# Altium project ALTAIR.PrjPcb (part 1 of 2)
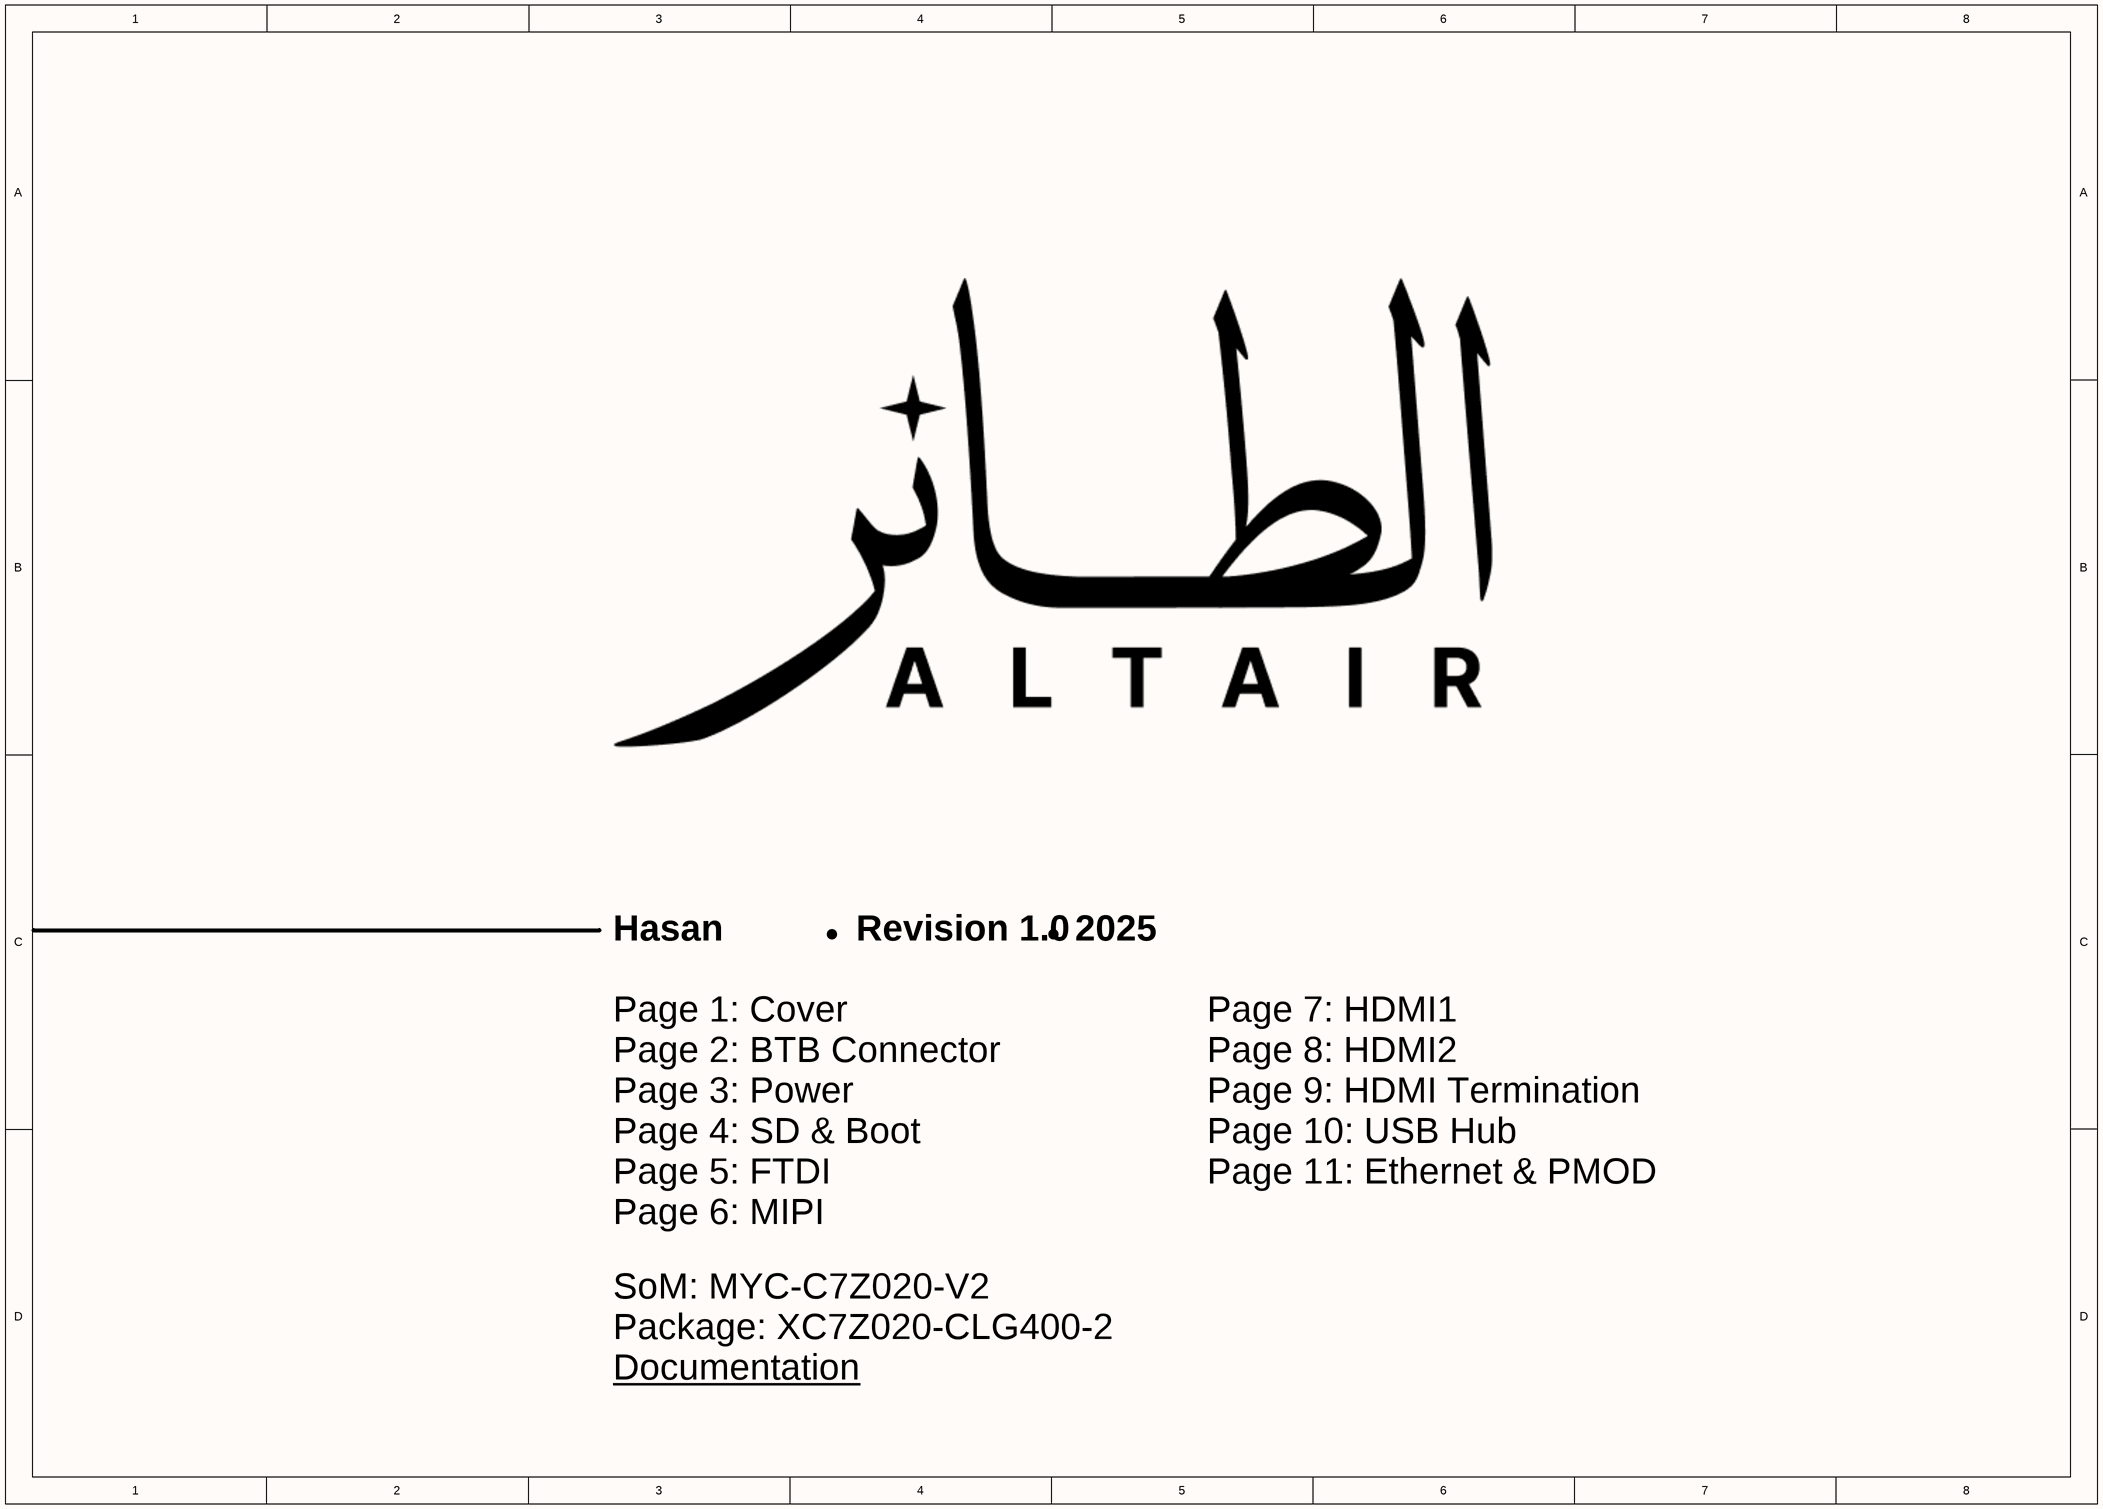
[diagram p0: Cover.SchDoc]

11 sheets, 524 parts. Net scope: global (net labels, ports and power ports of the same name join across sheets).
Board file: PCB1.PcbDoc
Sheets:
  Cover.SchDoc
  BTB Mezzanine.SchDoc
  Power.SchDoc
  SD & Boot.SchDoc
  FTDI.SchDoc
  MIPI.SchDoc
  HDMI1.SchDoc
  HDMI2.SchDoc
  HDMI Termination.SchDoc
  USB.SchDoc
  Ethernet & PMOD.SchDoc

## Sheet Cover.SchDoc: ALTAIR
size A3; SheetNumber: 1; SheetTotal: 11

### Notes on the sheet
- Hasan
- ·
- Revision 1.0
- 2025
- Page 1: Cover
- Page 7: HDMI1
- Page 2: BTB Connector
- Page 3: Power
- Page 8: HDMI2
- Page 9: HDMI Termination
- Page 4: SD & Boot
- Page 5: FTDI
- Page 10: USB Hub
- Page 11: Ethernet & PMOD
- Page 6: MIPI
- SoM: MYC-C7Z020-V2
- Package: XC7Z020-CLG400-2
- Documentation <https://github.com/HasanTheSyrian/ALTAIR>
- THIS DOCUMENT AND THE DATA DISCLOSED HEREIN OR
- HEREWITH IS THE PROPERTY OF ALTIUM LIMITED AND MAY
- DWG NO:
- REVISION
- REV:
- DESCRIPTION
- DATE
- APPROVED
- BE FREELY DISTRIBUTED IN WHOLE. NO RIGHTS ARE
- RESERVED OR EXPRESS OR IMPLIED WARANTEE GIVEN.
- ENG:
- APPROVALS
- PROJECT
- DSN:
- CHK:
- REFERENCE DOCUMENTS
- PROJECT REVISION:
- TITLE
- DOCUMENT REVISION:
- DESIGN ITEM:
- BOM:
- FAB DWG:
- PCB DWG:
- ASSY DWG:
- SCALE:
- A3
- SIZE
- CAGE CODE
- FILE NAME
- DWG NO.
- SHEET
- OF
- REV

## Sheet BTB Mezzanine.SchDoc
size A3; SheetNumber: 2; SheetTotal: 11
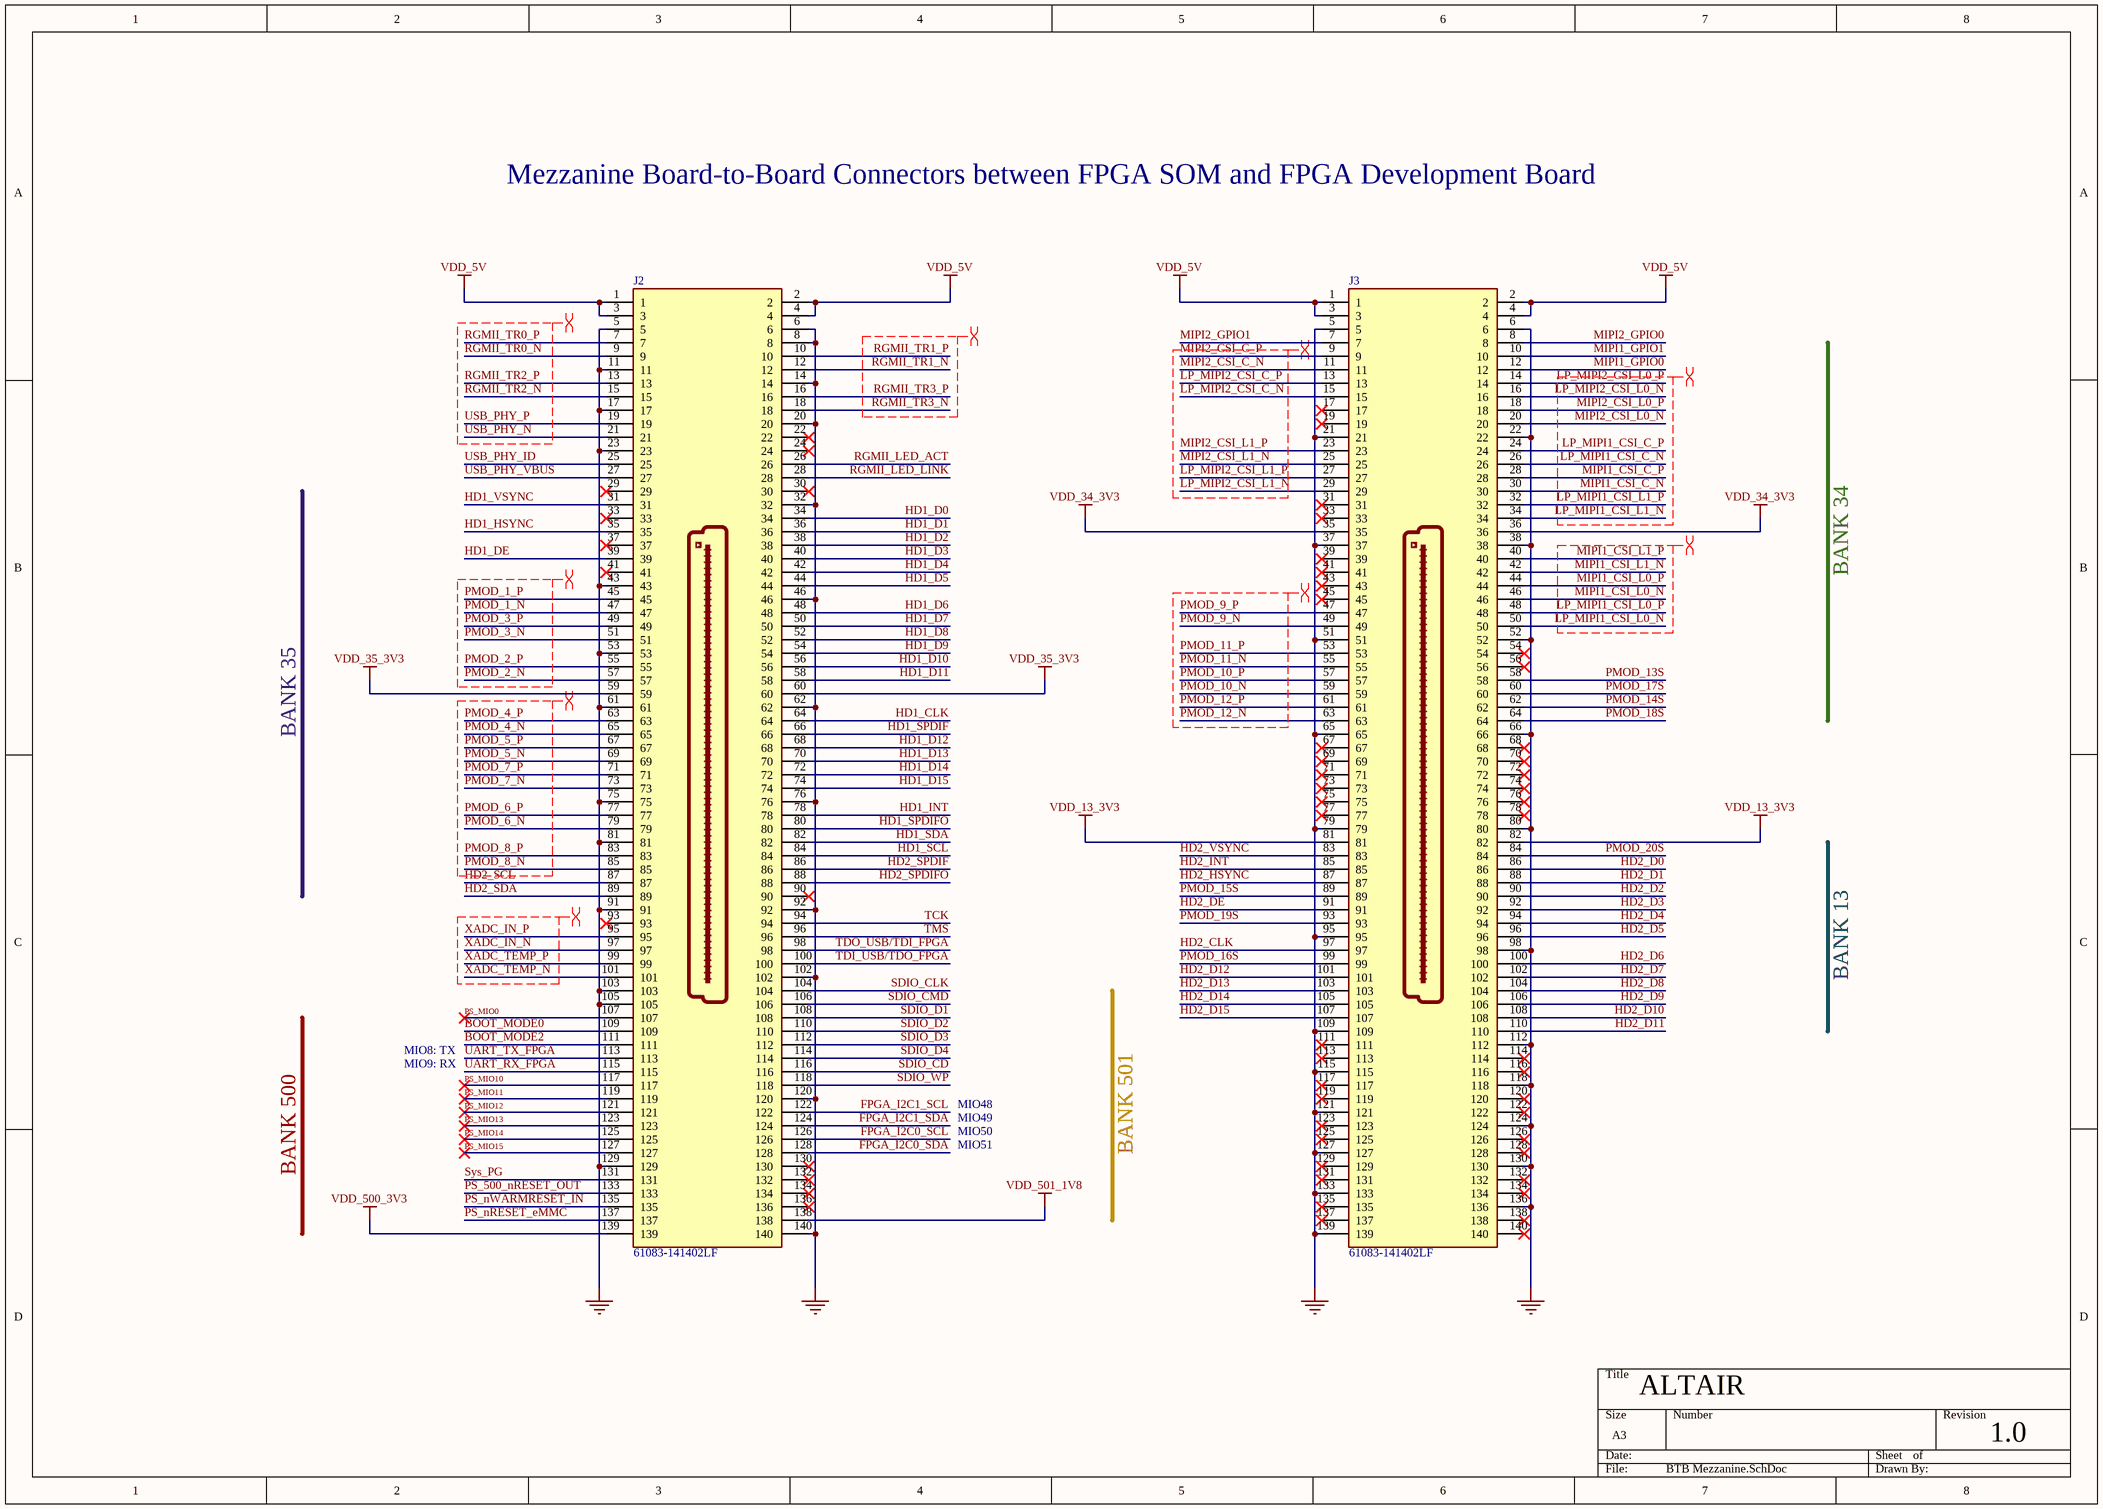
[diagram p1: BTB Mezzanine.SchDoc]

### Parts
J2  61083-141402LF  [61083141402LF]
J3  61083-141402LF  [61083141402LF]

### Nets
GND: J2.5 J2.6 J2.8 J2.11 J2.14 J2.17 J2.20 J2.23 J2.32 J2.43 J2.46 J2.53 J2.61 J2.62 J2.75 J2.76 J2.81 J2.91 J2.92 J2.102 J2.103 J2.105 J2.120 J2.129 J2.140 J3.5 J3.6 J3.21 J3.22 J3.37 J3.38 J3.51 J3.52 J3.65 J3.66 J3.79 J3.80 J3.95 J3.98 J3.109 J3.112 J3.115 J3.118 J3.121 J3.124 J3.127 J3.130 J3.133 J3.136 J3.139
VDD_5V: J2.1 J2.2 J2.3 J2.4 J3.1 J3.2 J3.3 J3.4  [project net 5V]
VDD_13_3V3: J3.81 J3.82
VDD_34_3V3: J3.35 J3.36
VDD_35_3V3: J2.59 J2.60
VDD_500_3V3: J2.139
VDD_501_1V8: J2.138
BOOT_MODE0: J2.109
BOOT_MODE2: J2.111
FPGA_I2C0_SCL: J2.126
FPGA_I2C0_SDA: J2.128
FPGA_I2C1_SCL: J2.122
FPGA_I2C1_SDA: J2.124
HD1_CLK: J2.64
HD1_D0: J2.34
HD1_D1: J2.36
HD1_D2: J2.38
HD1_D3: J2.40
HD1_D4: J2.42
HD1_D5: J2.44
HD1_D6: J2.48
HD1_D7: J2.50
HD1_D8: J2.52
HD1_D9: J2.54
HD1_D10: J2.56
HD1_D11: J2.58
HD1_D12: J2.68
HD1_D13: J2.70
HD1_D14: J2.72
HD1_D15: J2.74
HD1_DE: J2.39
HD1_HSYNC: J2.35
HD1_INT: J2.78
HD1_SCL: J2.84
HD1_SDA: J2.82
HD1_SPDIF: J2.66
HD1_SPDIFO: J2.80
HD1_VSYNC: J2.31
HD2_CLK: J3.97
HD2_D0: J3.86
HD2_D1: J3.88
HD2_D2: J3.90
HD2_D3: J3.92
HD2_D4: J3.94
HD2_D5: J3.96
HD2_D6: J3.100
HD2_D7: J3.102
HD2_D8: J3.104
HD2_D9: J3.106
HD2_D10: J3.108
HD2_D11: J3.110
HD2_D12: J3.101
HD2_D13: J3.103
HD2_D14: J3.105
HD2_D15: J3.107
HD2_DE: J3.91
HD2_HSYNC: J3.87
HD2_INT: J3.85
HD2_SCL: J2.87
HD2_SDA: J2.89
HD2_SPDIF: J2.86
HD2_SPDIFO: J2.88
HD2_VSYNC: J3.83
LP_MIPI1_CSI_C_N: J3.26
LP_MIPI1_CSI_C_P: J3.24
LP_MIPI1_CSI_L0_N: J3.50
LP_MIPI1_CSI_L0_P: J3.48
LP_MIPI1_CSI_L1_N: J3.34
LP_MIPI1_CSI_L1_P: J3.32
LP_MIPI2_CSI_C_N: J3.15
LP_MIPI2_CSI_C_P: J3.13
LP_MIPI2_CSI_L0_N: J3.16
LP_MIPI2_CSI_L0_P: J3.14
LP_MIPI2_CSI_L1_N: J3.29
LP_MIPI2_CSI_L1_P: J3.27
MIPI1_CSI_C_N: J3.30
MIPI1_CSI_C_P: J3.28
MIPI1_CSI_L0_N: J3.46
MIPI1_CSI_L0_P: J3.44
MIPI1_CSI_L1_N: J3.42
MIPI1_CSI_L1_P: J3.40
MIPI1_GPIO0: J3.12
MIPI1_GPIO1: J3.10
MIPI2_CSI_C_N: J3.11
MIPI2_CSI_C_P: J3.9
MIPI2_CSI_L0_N: J3.20
MIPI2_CSI_L0_P: J3.18
MIPI2_CSI_L1_N: J3.25
MIPI2_CSI_L1_P: J3.23
MIPI2_GPIO0: J3.8
MIPI2_GPIO1: J3.7
PMOD_1_N: J2.47
PMOD_1_P: J2.45
PMOD_2_N: J2.57
PMOD_2_P: J2.55
PMOD_3_N: J2.51
PMOD_3_P: J2.49
PMOD_4_N: J2.65
PMOD_4_P: J2.63
PMOD_5_N: J2.69
PMOD_5_P: J2.67
PMOD_6_N: J2.79
PMOD_6_P: J2.77
PMOD_7_N: J2.73
PMOD_7_P: J2.71
PMOD_8_N: J2.85
PMOD_8_P: J2.83
PMOD_9_N: J3.49
PMOD_9_P: J3.47
PMOD_10_N: J3.59
PMOD_10_P: J3.57
PMOD_11_N: J3.55
PMOD_11_P: J3.53
PMOD_12_N: J3.63
PMOD_12_P: J3.61
PMOD_13S: J3.58
PMOD_14S: J3.62
PMOD_15S: J3.89
PMOD_16S: J3.99
PMOD_17S: J3.60
PMOD_18S: J3.64
PMOD_19S: J3.93
PMOD_20S: J3.84
PS_500_nRESET_OUT: J2.133
PS_MIO0: J2.107
PS_MIO10: J2.117
PS_MIO11: J2.119
PS_MIO12: J2.121
PS_MIO13: J2.123
PS_MIO14: J2.125
PS_MIO15: J2.127
PS_nRESET_eMMC: J2.137
PS_nWARMRESET_IN: J2.135
RGMII_LED_ACT: J2.26
RGMII_LED_LINK: J2.28
RGMII_TR0_N: J2.9
RGMII_TR0_P: J2.7
RGMII_TR1_N: J2.12
RGMII_TR1_P: J2.10
RGMII_TR2_N: J2.15
RGMII_TR2_P: J2.13
RGMII_TR3_N: J2.18
RGMII_TR3_P: J2.16
SDIO_CD: J2.116
SDIO_CLK: J2.104
SDIO_CMD: J2.106
SDIO_D1: J2.108
SDIO_D2: J2.110
SDIO_D3: J2.112
SDIO_D4: J2.114
SDIO_WP: J2.118
Sys_PG: J2.131
TCK: J2.94
TDI_USB/TDO_FPGA: J2.100
TDO_USB/TDI_FPGA: J2.98
TMS: J2.96
UART_RX_FPGA: J2.115
UART_TX_FPGA: J2.113
USB_PHY_ID: J2.25
USB_PHY_N: J2.21
USB_PHY_P: J2.19
USB_PHY_VBUS: J2.27
XADC_IN_N: J2.97
XADC_IN_P: J2.95
XADC_TEMP_N: J2.101
XADC_TEMP_P: J2.99

Not connected (* = marked no-connect by the designer): J2 22* 24* 29* 30* 33* 37* 41* 90* 93* 130* 132* 134* 136*; J3 17* 19* 31* 33* 39* 41* 43* 45* 54* 56* 67* 68* 69* 70* 71* 72* 73* 74* 75* 76* 77* 78* 111* 113* 114* 116* 117* 119* 120* 122* 123* 125* 126* 128* 129* 131* 132* 134* 135* 137* 138* 140*

### Layout directives
differential pair: LP_MIPI1_CSI_C_N, LP_MIPI1_CSI_C_P, LP_MIPI1_CSI_L0_N, LP_MIPI1_CSI_L0_P, LP_MIPI1_CSI_L1_N, LP_MIPI1_CSI_L1_P, LP_MIPI2_CSI_C_N, LP_MIPI2_CSI_C_P, LP_MIPI2_CSI_L0_N, LP_MIPI2_CSI_L0_P, LP_MIPI2_CSI_L1_N, LP_MIPI2_CSI_L1_P, MIPI1_CSI_C_N, MIPI1_CSI_C_P, MIPI1_CSI_L0_N, MIPI1_CSI_L0_P, MIPI1_CSI_L1_N, MIPI1_CSI_L1_P, MIPI2_CSI_C_N, MIPI2_CSI_C_P, MIPI2_CSI_L0_N, MIPI2_CSI_L0_P, MIPI2_CSI_L1_N, MIPI2_CSI_L1_P, PMOD_1_N, PMOD_1_P, PMOD_2_N, PMOD_2_P, PMOD_3_N, PMOD_3_P, PMOD_4_N, PMOD_4_P, PMOD_5_N, PMOD_5_P, PMOD_6_N, PMOD_6_P, PMOD_7_N, PMOD_7_P, PMOD_8_N, PMOD_8_P, PMOD_9_N, PMOD_9_P, PMOD_10_N, PMOD_10_P, PMOD_11_N, PMOD_11_P, PMOD_12_N, PMOD_12_P, RGMII_TR0_N, RGMII_TR0_P, RGMII_TR1_N, RGMII_TR1_P, RGMII_TR2_N, RGMII_TR2_P, RGMII_TR3_N, RGMII_TR3_P, USB_PHY_N, USB_PHY_P, XADC_IN_N, XADC_IN_P, XADC_TEMP_N, XADC_TEMP_P

### Notes on the sheet
- Mezzanine Board-to-Board Connectors between FPGA SOM and FPGA Development Board
- BANK 34
- BANK 35
- BANK 13
- MIO8: TX
- MIO9: RX
- MIO49
- MIO48
- BANK 500
- MIO51
- MIO50
- BANK 501
- ALTAIR
- 1.0

### Library data of the parts
J2 J3 = 61083-141402LF: Connector; JLCPCB Part #: C5338666; Part No: 61083-141402LF; Footprint JLCPCB: SMD,P=0.8mm; Note/Misc: *

## Sheet Power.SchDoc
size A3; SheetNumber: 3; SheetTotal: 11
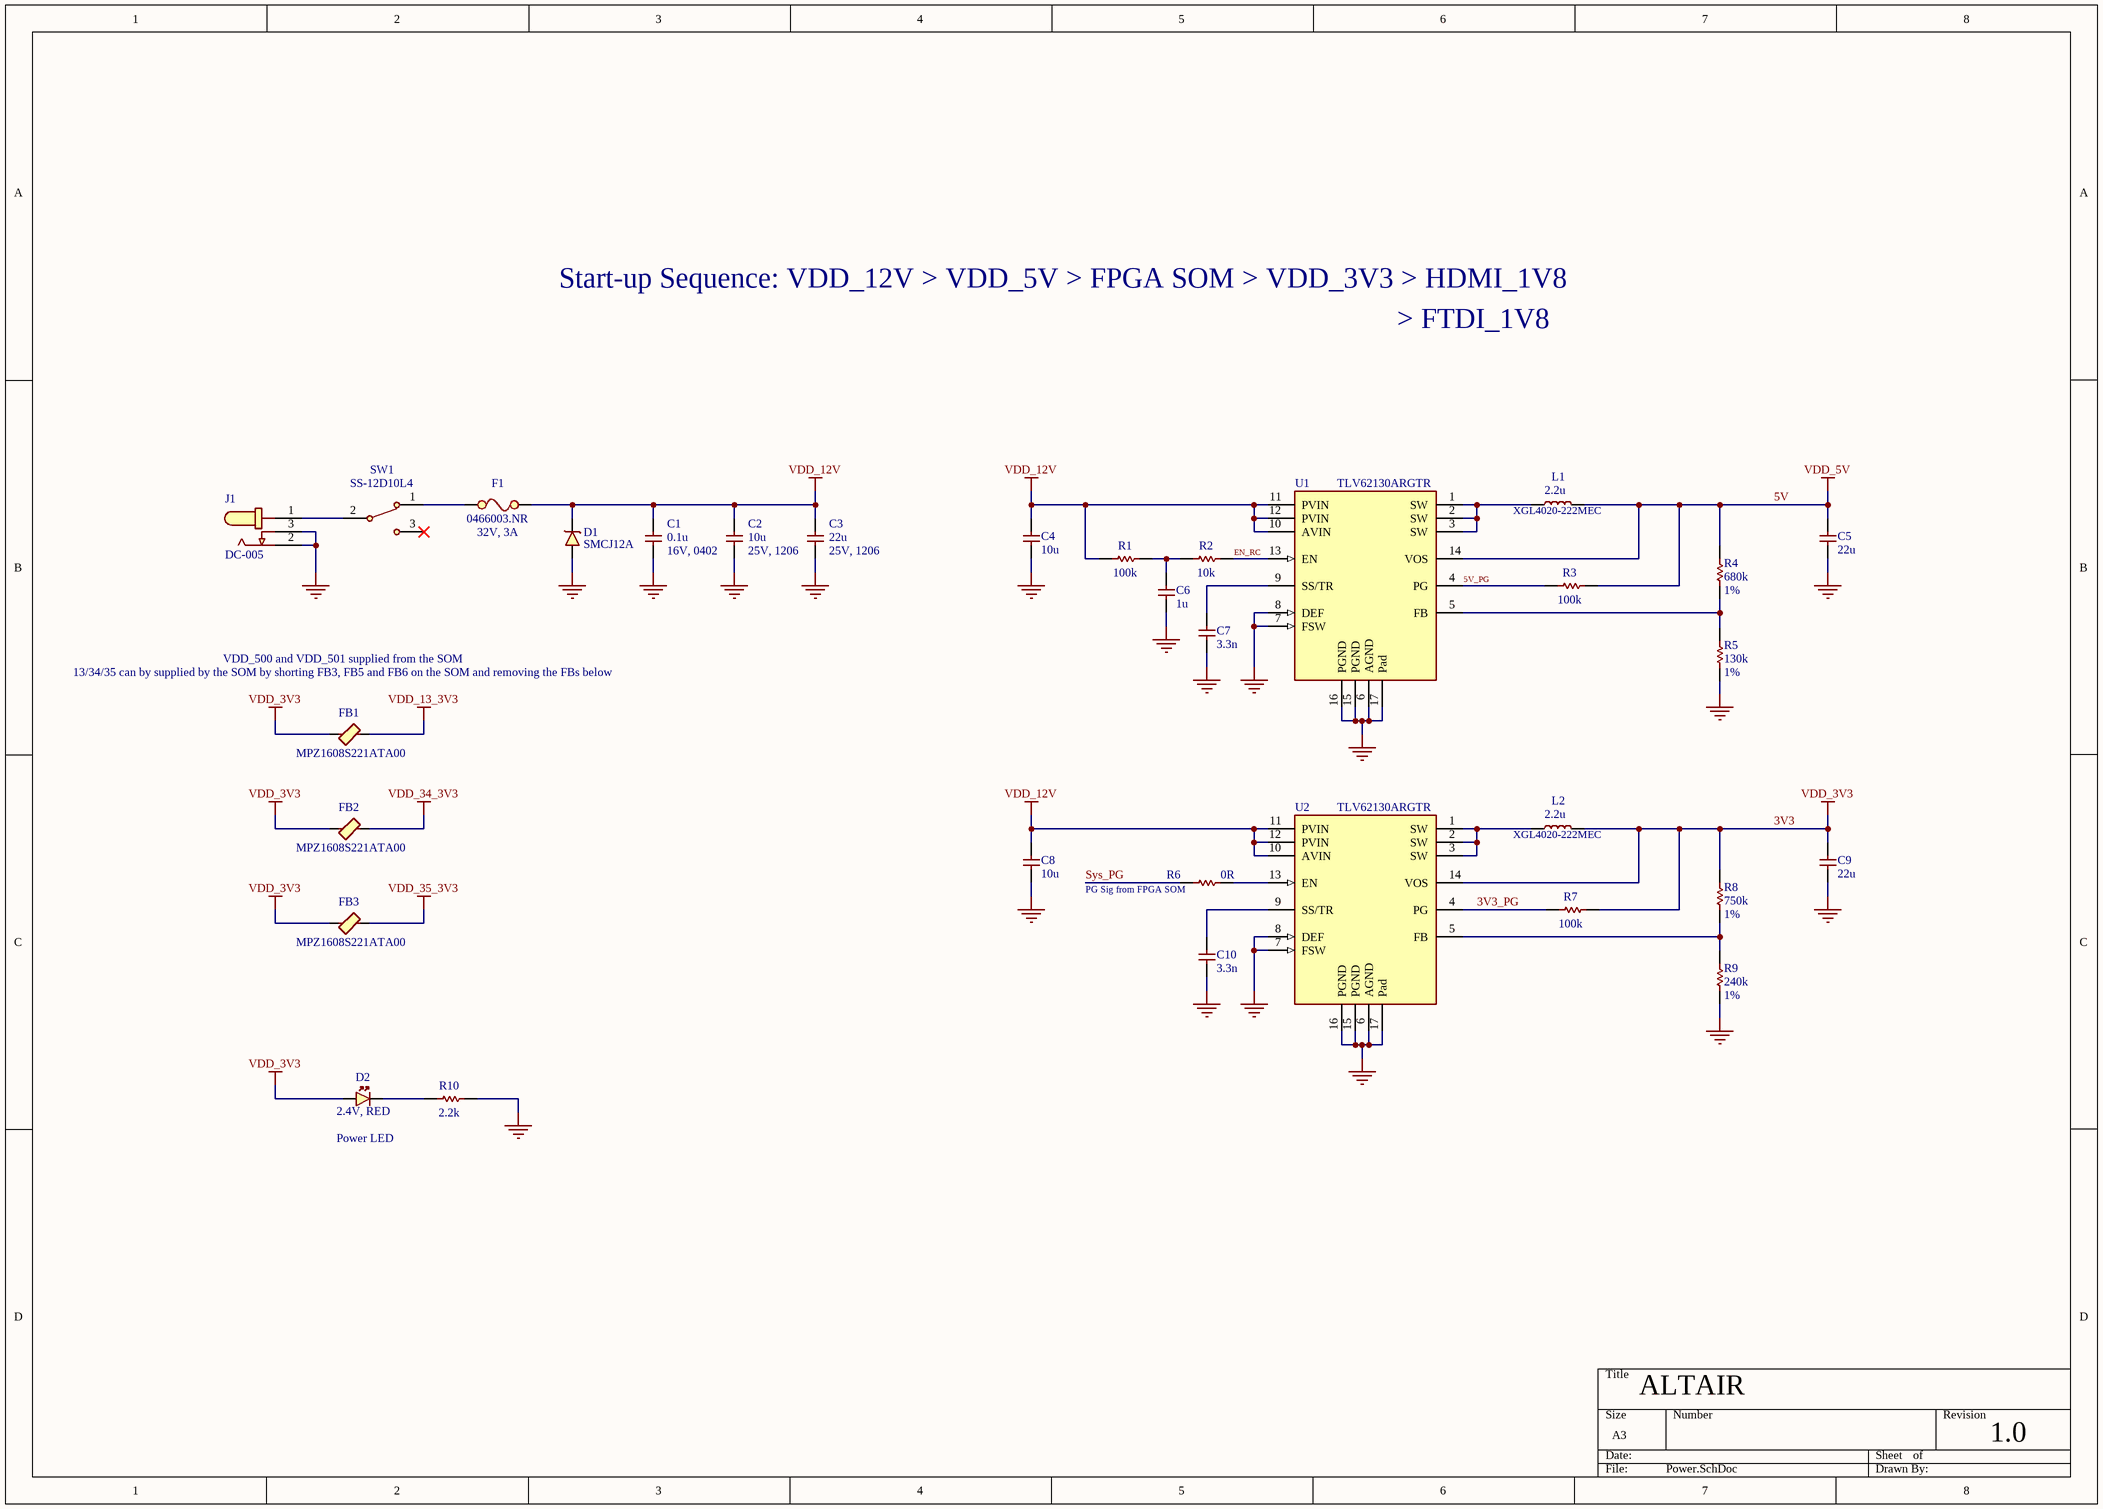
[diagram p2: Power.SchDoc]

### Parts
C1  0.1u  Note/Misc: 16V, 0402  [CAP_0402]
C2  10u  Note/Misc: 25V, 1206  [CAP_1206]
C3  22u  Note/Misc: 25V, 1206  [CAP_1206]
C4  10u  [CAP_1206]
C5  22u  [CAP_1206]
C6  1u  [CAP_0402]
C7  3.3n  [CAP_0402]
C8  10u  [CAP_1206]
C9  22u  [CAP_1206]
C10  3.3n  [CAP_0402]
D1  SMCJ12A  [LFUS-DO-214AB-2_V]
D2  Note/Misc: 2.4V, RED  [LED_0805_RED]  (hidden comment: RED)
F1  0466003.NR  Note/Misc: 32V, 3A  [0466003.NR]
FB1  220  [BEADC1608X75N]  (value not drawn)
FB2  220  [BEADC1608X75N]  (value not drawn)
FB3  220  [BEADC1608X75N]  (value not drawn)
J1  DC-005  [DC-005-A200]
L1  2.2u  Note/Misc: XGL4020-222MEC  [XGL4020222MEC]
L2  2.2u  Note/Misc: XGL4020-222MEC  [XGL4020222MEC]
R1  100k  [RES_0402]
R2  10k  [RES_0402]
R3  100k  [RES_0402]
R4  680k  Note/Misc: 1%  [RES_0402]
R5  130k  Note/Misc: 1%  [RES_0402]
R6  0R  [RES_0402]
R7  100k  [RES_0402]
R8  750k  Note/Misc: 1%  [RES_0402]
R9  240k  Note/Misc: 1%  [RES_0402]
R10  2.2k  [RES_0402]
SW1  SS-12D10L4  [SS-12D10L5]
U1  TLV62130ARGTR  [FP-RGT0016C-MFG]
U2  TLV62130ARGTR  [FP-RGT0016C-MFG]

### Nets
3V3: C9.2 D2.A FB1.1 FB2.1 FB3.1 L2.2 R7.2 R8.2 U2.14(VOS)  [also labelled VDD_3V3]
5V: C5.2 L1.2 R3.2 R4.2 U1.14(VOS)  [also labelled VDD_5V]
GND: C1.1 C2.1 C3.1 C4.1 C5.1 C6.1 C7.1 C8.1 C9.1 C10.1 D1.2 J1.2 J1.3 R5.2 R9.2 R10.2 U1.6(AGND) U1.7(FSW) U1.8(DEF) U1.15(PGND) U1.16(PGND) U1.17(Pad) U2.6(AGND) U2.7(FSW) U2.8(DEF) U2.15(PGND) U2.16(PGND) U2.17(Pad)
VDD_12V: C1.2 C2.2 C3.2 C4.2 C8.2 D1.1 F1.2 R1.2 U1.10(AVIN) U1.11(PVIN) U1.12(PVIN) U2.10(AVIN) U2.11(PVIN) U2.12(PVIN)
VDD_13_3V3: FB1.2
VDD_34_3V3: FB2.2
VDD_35_3V3: FB3.2
3V3_PG: R7.1 U2.4(PG)
5V_PG: R3.1 U1.4(PG)
EN_RC: R2.1 U1.13(EN)
Sys_PG: R6.1
NetC6_2: C6.2 R1.1 R2.2
NetC7_2: C7.2 U1.9(SS/TR)
NetC10_2: C10.2 U2.9(SS/TR)
NetD2_K: D2.K R10.1
NetF1_1: F1.1 SW1.1
NetJ1_1: J1.1 SW1.2(C)
NetL1_1: L1.1 U1.1(SW) U1.2(SW) U1.3(SW)
NetL2_1: L2.1 U2.1(SW) U2.2(SW) U2.3(SW)
NetR4_1: R4.1 R5.1 U1.5(FB)
NetR6_2: R6.2 U2.13(EN)
NetR8_1: R8.1 R9.1 U2.5(FB)

Not connected (* = marked no-connect by the designer): SW1 3*

### Notes on the sheet
- Start-up Sequence: VDD_12V > VDD_5V > FPGA SOM > VDD_3V3 > HDMI_1V8
- > FTDI_1V8
- 13/34/35 can by supplied by the SOM by shorting FB3, FB5 and FB6 on the SOM and removing the FBs below
- VDD_500 and VDD_501 supplied from the SOM
- (near R6) PG Sig from FPGA SOM
- (near D2) Power LED
- ALTAIR
- 1.0

### Library data of the parts
C1 = CAP_0402: Capacitor SMD 0402; Part No: CL05B104KO5NNNC; LCSC: *; JLCPCB Part #: C338112; Footprint JLCPCB: 0402
C2 = CAP_1206: Capacitor SMD 1206; Part No: CL31A106KAHNNNE; LCSC: *; JLCPCB Part #: C9807; Footprint JLCPCB: 1206
C3 = CAP_1206: Capacitor SMD 1206; Part No: CL31A226KAHNNNE; LCSC: *; JLCPCB Part #: C12891; Footprint JLCPCB: 1206
C4 C8 = CAP_1206: Capacitor SMD 1206; Part No: CL31A106KAHNNNE; Note/Misc: 25V, 1206; LCSC: *; JLCPCB Part #: C9807; Footprint JLCPCB: 1206
C5 C9 = CAP_1206: Capacitor SMD 1206; Part No: CL31A226KAHNNNE; Note/Misc: 25V, 1206; LCSC: *; JLCPCB Part #: C12891; Footprint JLCPCB: 1206
C6 = CAP_0402: Capacitor SMD 0402; Part No: CL05A105KP5NNNC; Note/Misc: 10V; LCSC: *; JLCPCB Part #: C14445; Footprint JLCPCB: 0402
C7 C10 = CAP_0402: Capacitor SMD 0402; Part No: CC0402JRX7R8BB332; LCSC: *; JLCPCB Part #: C527004; Footprint JLCPCB: 0402
D1 = SMCJ12A: Transient Voltage Suppression Diode, 12 V, -65 to 150 degC, 2-Pin DO-214AB (SMCJ), RoHS, Tape and Reel; Footprint JLCPCB: DO-214AB(SMCJ); JLCPCB Part #: C224038; Part No: SMCJ12A
D2 = LED_0805_RED: LED 0805 RED SMD; Part No: HL-PSC-2012S9AC; LCSC: *; Footprint JLCPCB: 0805; JLCPCB Part #: C497952
F1 = 0466003.NR: FUSE MNT 3A 32VAC/VDC 1206; JLCPCB Part #: C14165; LCSC: *; Footprint JLCPCB: 1206; Part No: 0466003.NR
FB1-FB3 = MPZ1608S221ATA00: Ferrite Bead; LCSC: *; Note/Misc: *; Part No: MPZ1608S221ATA00; JLCPCB Part #: C76815; Footprint JLCPCB: 0603
J1 = DC-005: DC Jack; Footprint JLCPCB: Plugin; JLCPCB Part #: C720557; Part No: DC-005
L1 L2 = IND_XGL4020-222MEC: Inductor SMD 2.2 uH; LCSC: *; Part No: XGL4020-222MEC; JLCPCB Part #: C6012410; Footprint JLCPCB: 1616
R1 R3 R7 = RES_0402: Resistor SMD 0402; Part No: RC0402JR-07100KL; LCSC: *; JLCPCB Part #: C106234; Footprint JLCPCB: 0402
R2 = RES_0402: Resistor SMD 0402; Part No: RC0402JR-0710KL; LCSC: *; JLCPCB Part #: C60489; Footprint JLCPCB: 0402
R4 = RES_0402: Resistor SMD 0402; Part No: RC0402FR-07680KL; LCSC: *; JLCPCB Part #: C163456; Footprint JLCPCB: 0402
R5 = RES_0402: Resistor SMD 0402; Part No: RC0402FR-07130KL; LCSC: *; JLCPCB Part #: C93946; Footprint JLCPCB: 0402
R6 = RES_0402: Resistor SMD 0402; Part No: RC0402JR-070RL; LCSC: *; JLCPCB Part #: C60485; Footprint JLCPCB: 0402
R8 = RES_0402: Resistor SMD 0402; Part No: RC0402FR-07750KL; LCSC: *; JLCPCB Part #: C137937; Footprint JLCPCB: 0402
R9 = RES_0402: Resistor SMD 0402; Part No: RC0402FR-07240KL; LCSC: *; JLCPCB Part #: C138029; Footprint JLCPCB: 0402
R10 = RES_0402: Resistor SMD 0402; Part No: RC0402JR-072K2L; LCSC: *; JLCPCB Part #: C163447; Footprint JLCPCB: 0402
SW1 = SS-12D10L5: Slide Switch; LCSC: *; Note/Misc: *; Part No: SS-12D10L4; JLCPCB Part #: C843364; Footprint JLCPCB: Plugin
U1 U2 = TLV62130ARGTR: IC REG BUCK ADJUSTABLE 3A 16QFN; JLCPCB Part #: C138520; Note/Misc: *; Footprint JLCPCB: VQFN-16-EP(3x3); Part No: TLV62130ARGTR

## Sheet SD & Boot.SchDoc
size A3; SheetNumber: 4; SheetTotal: 11
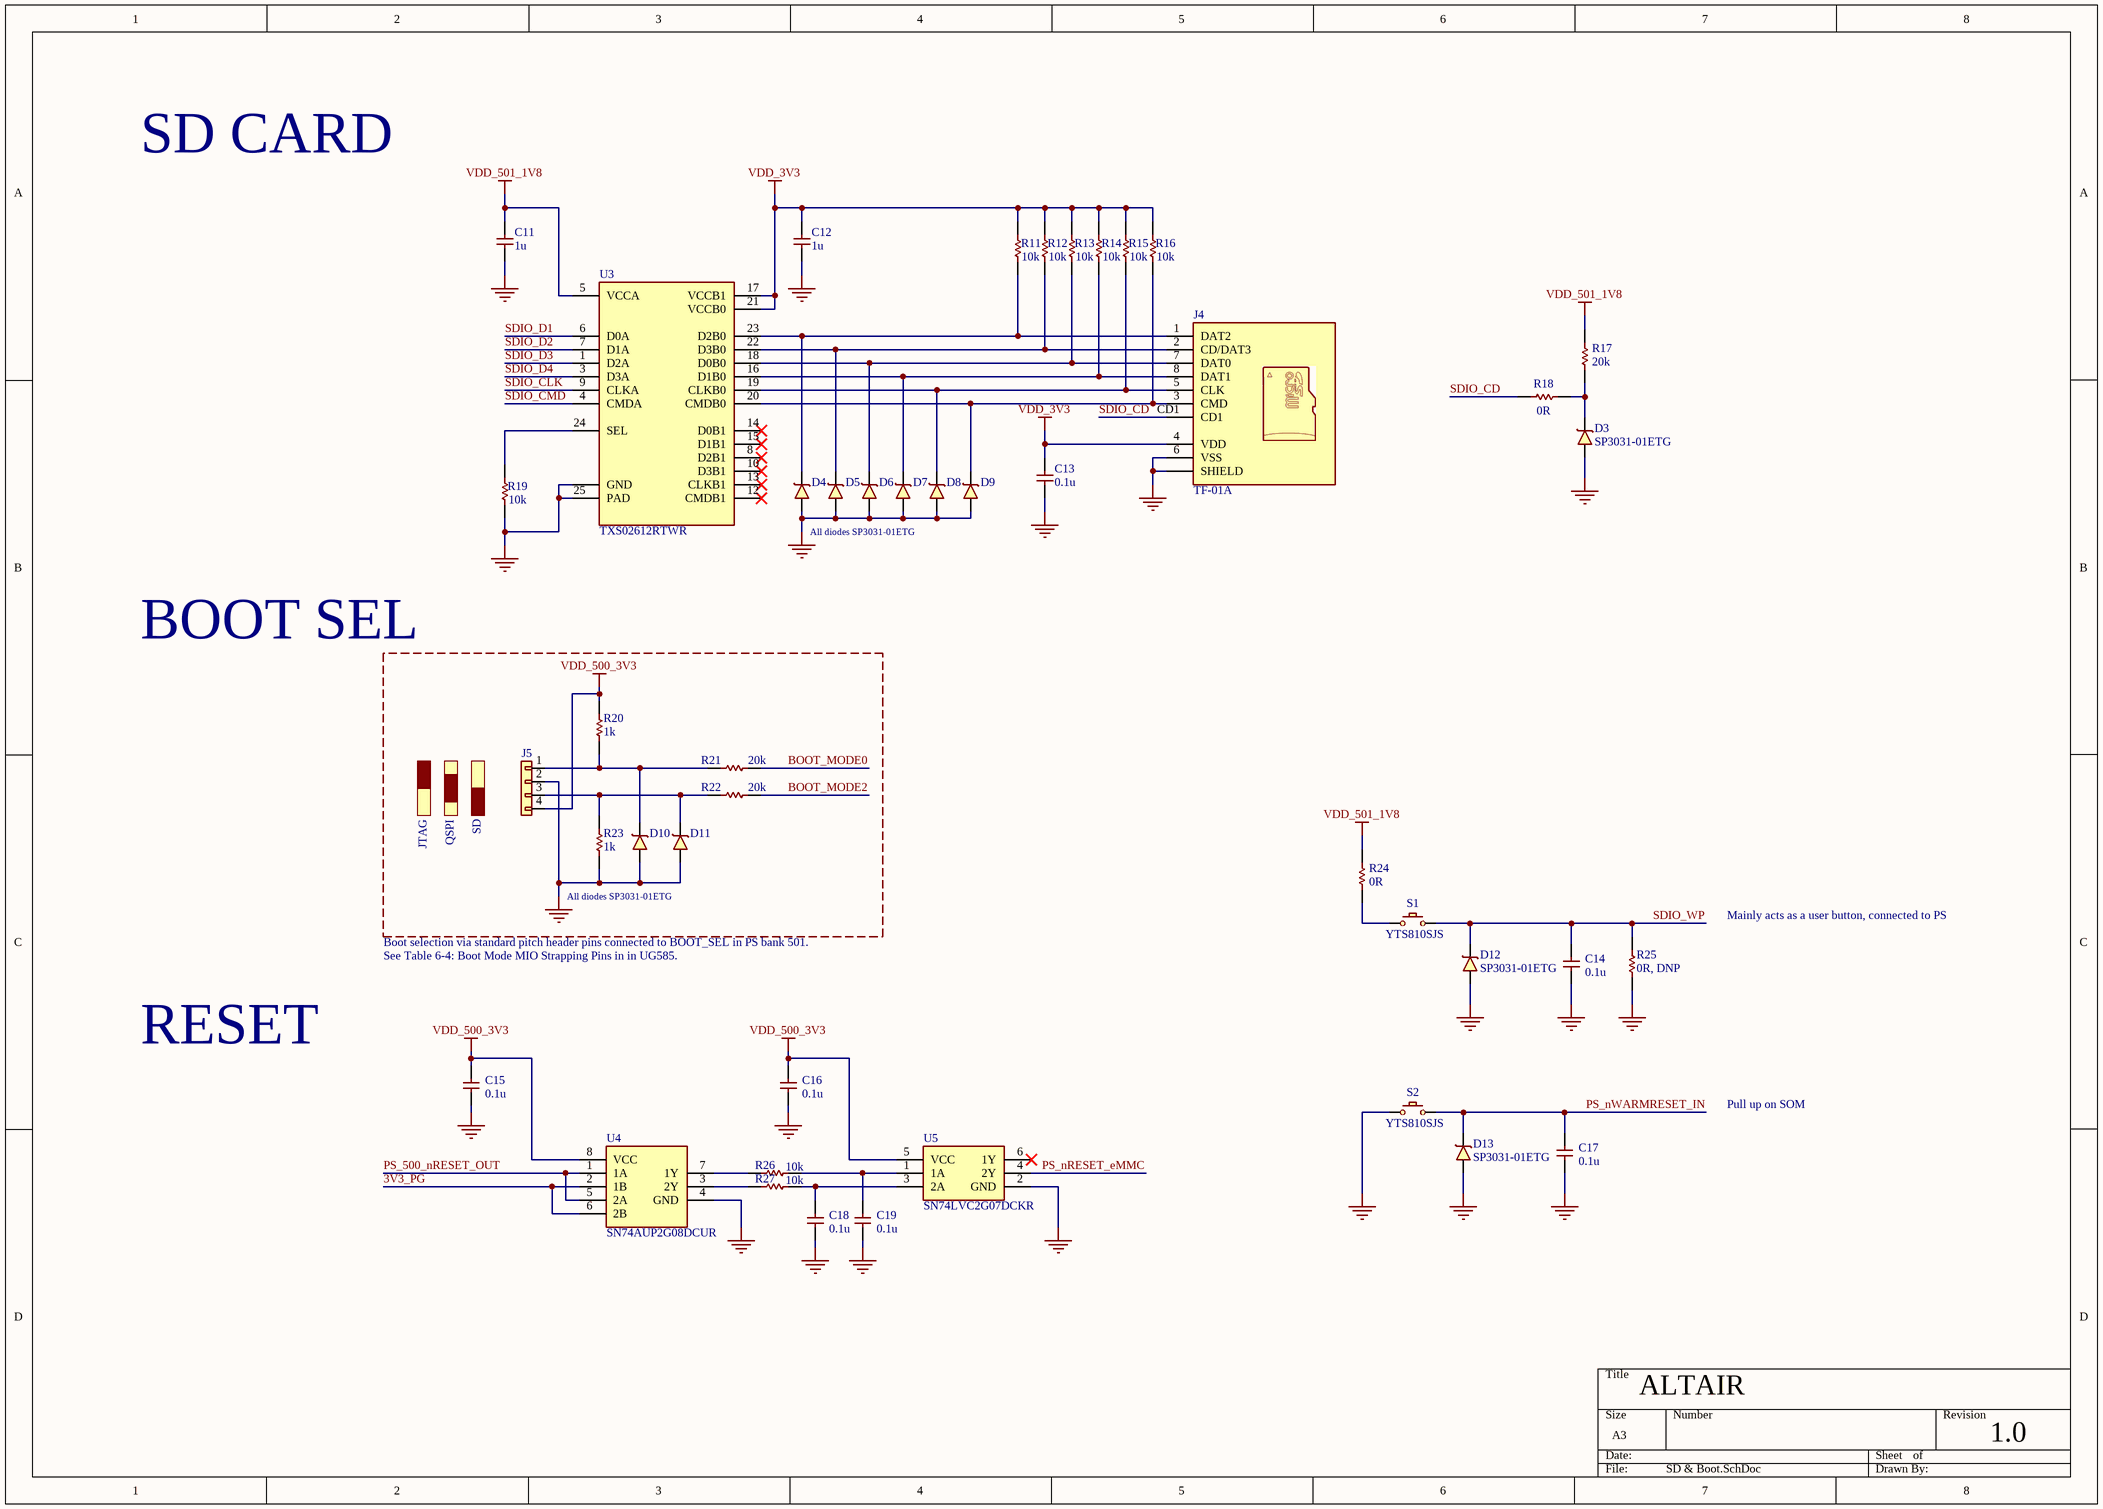
[diagram p3: SD & Boot.SchDoc]

### Parts
C11  1u  [CAP_0402]
C12  1u  [CAP_0402]
C13  0.1u  [CAP_0402]
C14  0.1u  [CAP_0402]
C15  0.1u  [CAP_0402]
C16  0.1u  [CAP_0402]
C17  0.1u  [CAP_0402]
C18  0.1u  [CAP_0402]
C19  0.1u  [CAP_0402]
D3  SP3031-01ETG  [SP303101ETG]
D4  SP3031-01ETG  [SP303101ETG]  (value not drawn)
D5  SP3031-01ETG  [SP303101ETG]  (value not drawn)
D6  SP3031-01ETG  [SP303101ETG]  (value not drawn)
D7  SP3031-01ETG  [SP303101ETG]  (value not drawn)
D8  SP3031-01ETG  [SP303101ETG]  (value not drawn)
D9  SP3031-01ETG  [SP303101ETG]  (value not drawn)
D10  SP3031-01ETG  [SP303101ETG]  (value not drawn)
D11  SP3031-01ETG  [SP303101ETG]  (value not drawn)
D12  SP3031-01ETG  [SP303101ETG]
D13  SP3031-01ETG  [SP303101ETG]
J4  TF-01A  [TF01A]
J5  4xHeader  [HDRV4W95P0X254_1X4_1016X254X854P]  (value not drawn)
R11  10k  [RES_0402]
R12  10k  [RES_0402]
R13  10k  [RES_0402]
R14  10k  [RES_0402]
R15  10k  [RES_0402]
R16  10k  [RES_0402]
R17  20k  [RES_0402]
R18  0R  [RES_0402]
R19  10k  [RES_0402]
R20  1k  [RES_0402]
R21  20k  [RES_0402]
R22  20k  [RES_0402]
R23  1k  [RES_0402]
R24  0R  [RES_0402]
R25  0R, DNP  [RES_0402]
R26  10k  [RES_0402]
R27  10k  [RES_0402]
S1  YTS810SJS  [YTS810SJS]
S2  YTS810SJS  [YTS810SJS]
U3  TXS02612RTWR  [QFN50P400X400X80-25N-D]
U4  SN74AUP2G08DCUR  [SOP50P310X90-8N]
U5  SN74LVC2G07DCKR  [SOT65P210X110-6N]

### Nets
GND: C11.1 C12.1 C13.1 C14.1 C15.1 C16.1 C17.1 C18.1 C19.1 D3.2(A) D4.2(A) D5.2(A) D6.2(A) D7.2(A) D8.2(A) D9.2(A) D10.2(A) D11.2(A) D12.2(A) D13.2(A) J4.6(VSS) J4.SHLD(SHIELD) J5.2 R19.2 R23.2 R25.2 S2.1 U3.25(PAD) U3.GND U4.4(GND) U5.2(GND)
VDD_3V3: C12.2 C13.2 J4.4(VDD) R11.1 R12.1 R13.1 R14.1 R15.1 R16.1 U3.17(VCCB1) U3.21(VCCB0)  [project net 3V3]
VDD_500_3V3: C15.2 C16.2 J5.4 R20.1 U4.8(VCC) U5.5(VCC)
VDD_501_1V8: C11.2 R17.1 R24.1 U3.5(VCCA)
3V3_PG: U4.2(1B) U4.6(2B)
BOOT_MODE0: R21.2
BOOT_MODE2: R22.2
PS_500_nRESET_OUT: U4.1(1A) U4.5(2A)
PS_nRESET_eMMC: U5.4(2Y)
PS_nWARMRESET_IN: C17.2 D13.1(K) S2.2
SDIO_CD: J4.CD1 R18.1
SDIO_CLK: U3.9(CLKA)
SDIO_CMD: U3.4(CMDA)
SDIO_D1: U3.6(D0A)
SDIO_D2: U3.7(D1A)
SDIO_D3: U3.1(D2A)
SDIO_D4: U3.3(D3A)
SDIO_WP: C14.2 D12.1(K) R25.1 S1.2
NetC18_2: C18.2 R27.2 U5.3(2A)
NetC19_2: C19.2 R26.2 U5.1(1A)
NetD3_1: D3.1(K) R17.2 R18.2
NetD4_1: D4.1(K) J4.1(DAT2) R11.2 U3.23(D2B0)
NetD5_1: D5.1(K) J4.2(CD/DAT3) R12.2 U3.22(D3B0)
NetD6_1: D6.1(K) J4.7(DAT0) R13.2 U3.18(D0B0)
NetD7_1: D7.1(K) J4.8(DAT1) R14.2 U3.16(D1B0)
NetD8_1: D8.1(K) J4.5(CLK) R15.2 U3.19(CLKB0)
NetD9_1: D9.1(K) J4.3(CMD) R16.2 U3.20(CMDB0)
NetD10_1: D10.1(K) J5.1 R20.2 R21.1
NetD11_1: D11.1(K) J5.3 R22.1 R23.1
NetR19_1: R19.1 U3.24(SEL)
NetR24_2: R24.2 S1.1
NetR26_1: R26.1 U4.7(1Y)
NetR27_1: R27.1 U4.3(2Y)

Not connected (* = marked no-connect by the designer): U3 8(D2B1)* 10(D3B1)* 12(CMDB1)* 13(CLKB1)* 14(D0B1)* 15(D1B1)*; U5 6(1Y)*

### Notes on the sheet
- SD CARD
- All diodes SP3031-01ETG
- BOOT SEL
- JTAG
- QSPI
- (near J5) SD
- Mainly acts as a user button, connected to PS
- Boot selection via standard pitch header pins connected to BOOT_SEL in PS bank 501.
- See Table 6-4: Boot Mode MIO Strapping Pins in in UG585.
- RESET
- Pull up on SOM
- ALTAIR
- 1.0

### Library data of the parts
C11 C12 = CAP_0402: as C6 on sheet Power; LCSC: *; JLCPCB Part #: C14445; Footprint JLCPCB: 0402
C13-C19 = CAP_0402: Capacitor SMD 0402; Part No: CL05B104KO5NNNC; Note/Misc: 16V, 0402; LCSC: *; JLCPCB Part #: C338112; Footprint JLCPCB: 0402
D3-D13 = SP3031-01ETG: TVS Diode (Uni-directional); Footprint JLCPCB: SOD-882; JLCPCB Part #: C207283; LCSC: *; Note/Misc: *; Part No: SP3031-01ETG
J4 = TF-01A: SD CARD Connector Slot; LCSC: *; Note/Misc: *; Part No: TF-01A; JLCPCB Part #: C91145; Footprint JLCPCB: SMD
J5 = 4xHeader: Standard 4 pin 2.54mm pitch connector; Part No: X6511WV-04H-C60D30; Footprint JLCPCB: Plugin,P=2.54mm; JLCPCB Part #: C706876
R11-R16 R19 R26 R27 = RES_0402: as R2 on sheet Power; LCSC: *; JLCPCB Part #: C60489; Footprint JLCPCB: 0402
R17 R21 R22 = RES_0402: Resistor SMD 0402; Part No: RC0402FR-0720KL; LCSC: *; JLCPCB Part #: C93942; Footprint JLCPCB: 0402
R18 R24 R25 = RES_0402: as R6 on sheet Power; LCSC: *; JLCPCB Part #: C60485; Footprint JLCPCB: 0402
  R25: Note/Misc: DNP
R20 R23 = RES_0402: Resistor SMD 0402; Part No: RC0402JR-071KL; LCSC: *; JLCPCB Part #: C105637; Footprint JLCPCB: 0402
S1 S2 = YTS810SJS: Button SMD 4-Pin; Footprint JLCPCB: SMD; JLCPCB Part #: C2910646; Part No: YTS810SJS
U3 = TXS02612RTWR: SD Card Level Shifter Integrated Circuit; LCSC: *; Footprint JLCPCB: WQFN-24-EP(4x4); JLCPCB Part #: C140276; Note/Misc: *; Part No: TXS02612RTWR
U4 = SN74AUP2G08DCUR: AND Gate 2 inputs 2 outputs Integrated Circuit; Footprint JLCPCB: VSSOP-8-0.5mm; JLCPCB Part #: C544478; Part No: SN74AUP2G08DCUR
U5 = SN74LVC2G07DCKR: Buffer Gate 1 input 1 output; Footprint JLCPCB: SC-70-6; JLCPCB Part #: C7849; Part No: SN74LVC2G07DCKR

## Sheet FTDI.SchDoc
size A3; SheetNumber: 5; SheetTotal: 11
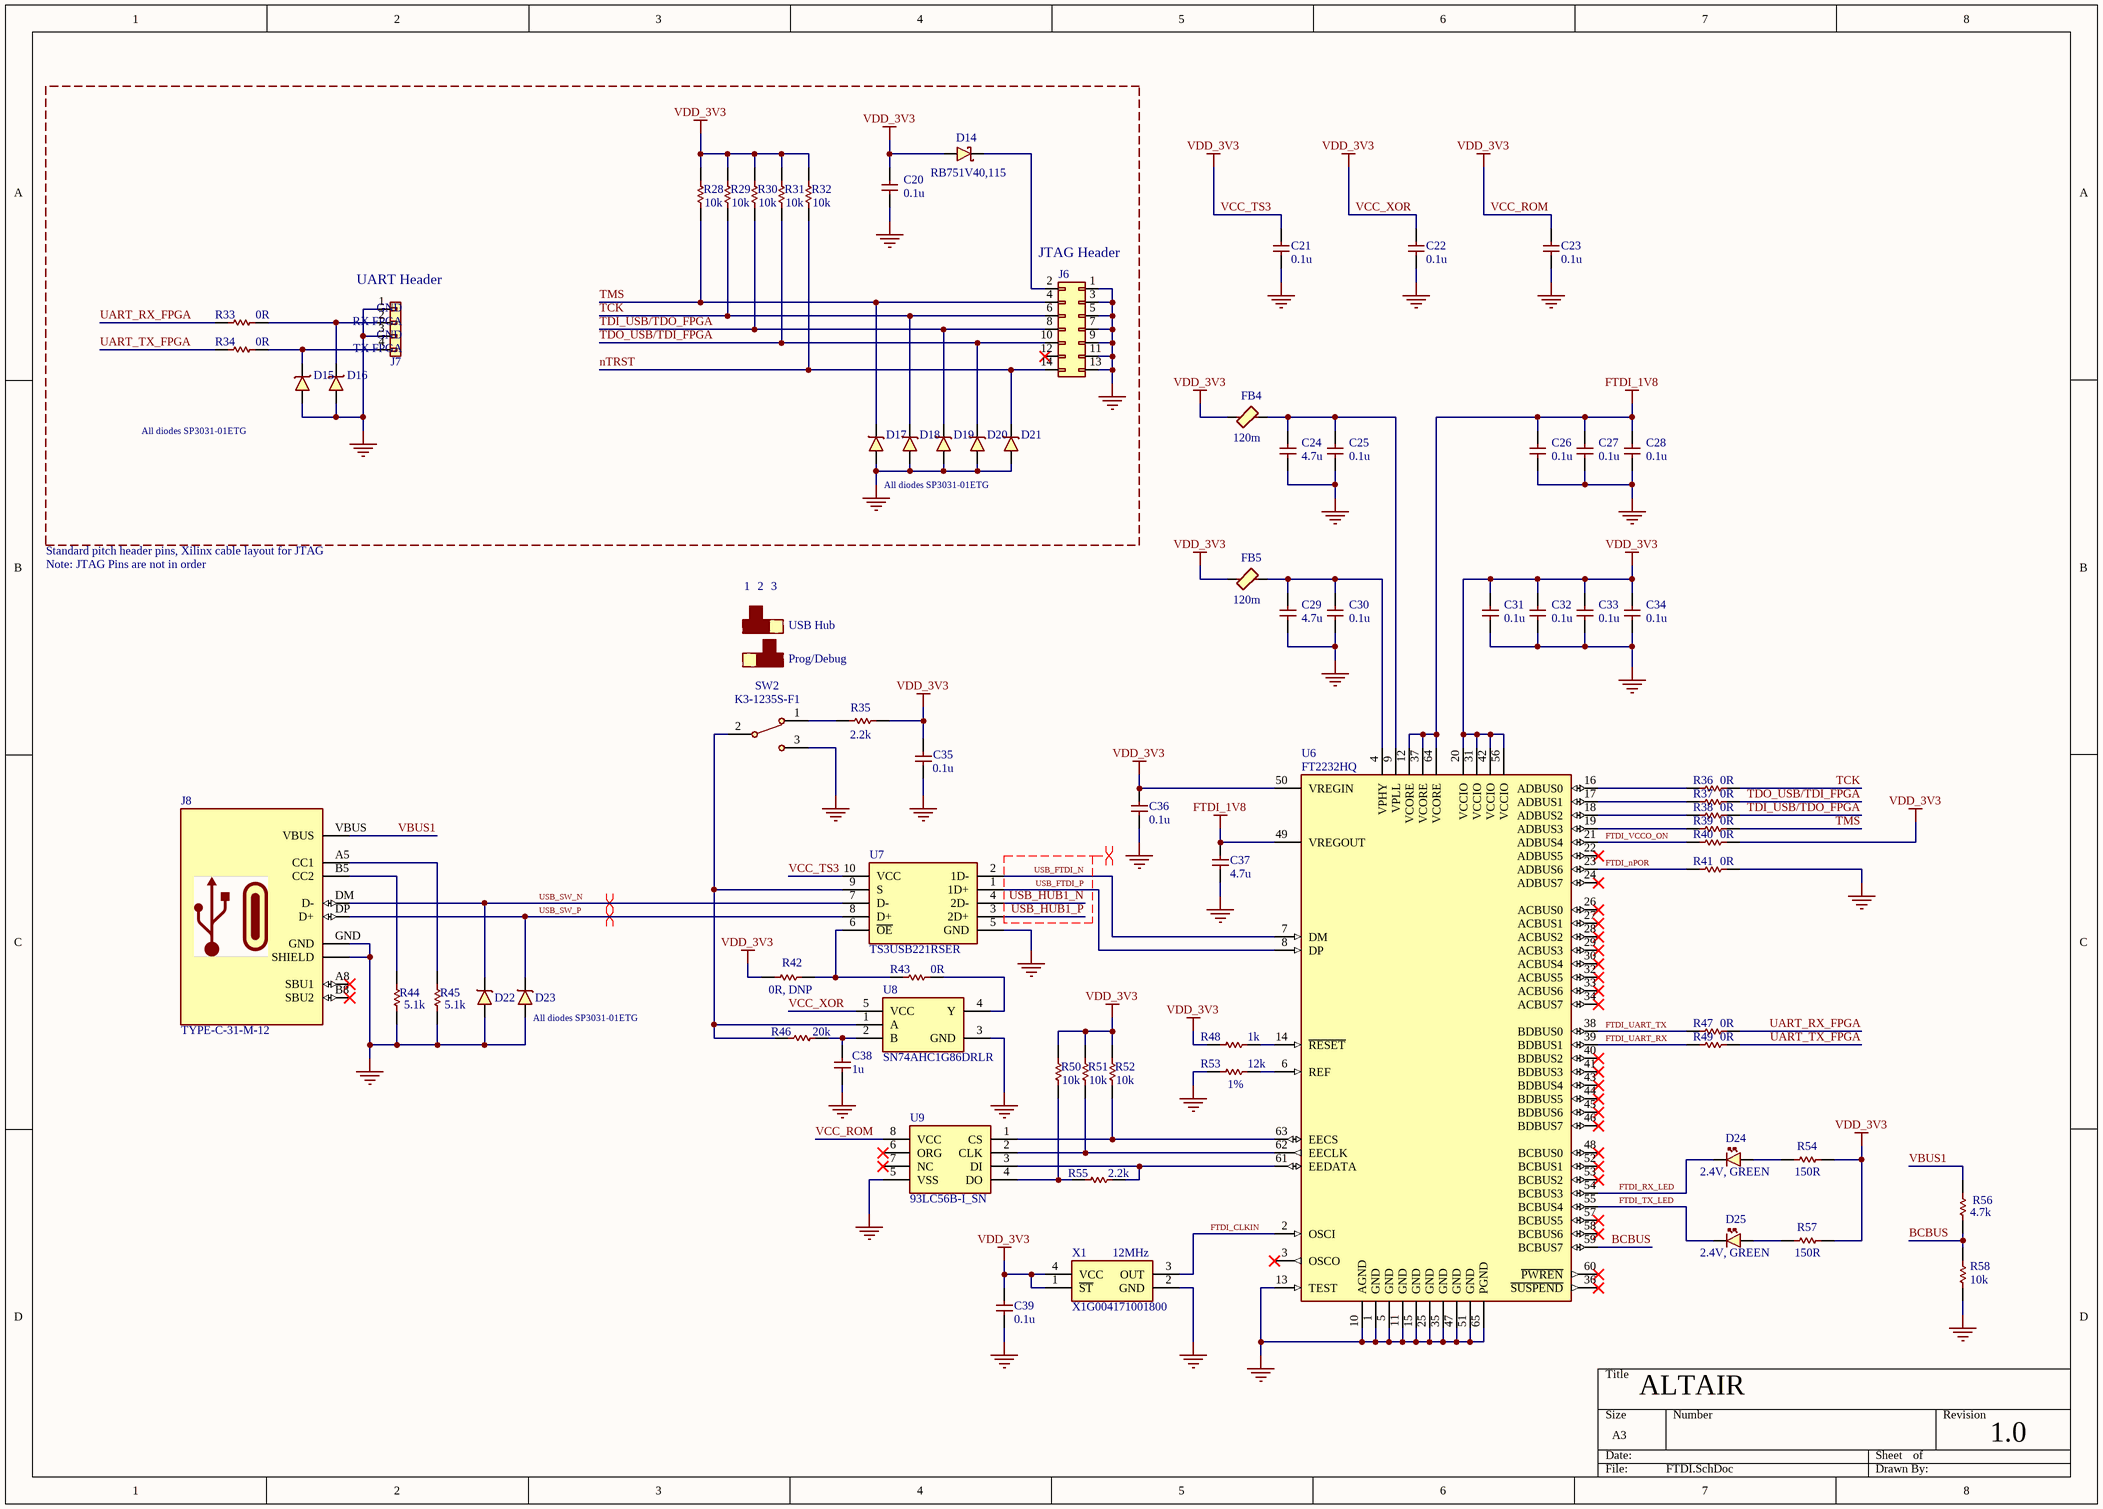
[diagram p4: FTDI.SchDoc]

### Parts
C20  0.1u  [CAP_0402]
C21  0.1u  [CAP_0402]
C22  0.1u  [CAP_0402]
C23  0.1u  [CAP_0402]
C24  4.7u  [CAP_0402]
C25  0.1u  [CAP_0402]
C26  0.1u  [CAP_0402]
C27  0.1u  [CAP_0402]
C28  0.1u  [CAP_0402]
C29  4.7u  [CAP_0402]
C30  0.1u  [CAP_0402]
C31  0.1u  [CAP_0402]
C32  0.1u  [CAP_0402]
C33  0.1u  [CAP_0402]
C34  0.1u  [CAP_0402]
C35  0.1u  [CAP_0402]
C36  0.1u  [CAP_0402]
C37  4.7u  [CAP_0402]
C38  1u  [CAP_0402]
C39  0.1u  [CAP_0402]
D14  RB751V40,115  [SOD2512X110N]
D15  SP3031-01ETG  [SP303101ETG]  (value not drawn)
D16  SP3031-01ETG  [SP303101ETG]  (value not drawn)
D17  SP3031-01ETG  [SP303101ETG]  (value not drawn)
D18  SP3031-01ETG  [SP303101ETG]  (value not drawn)
D19  SP3031-01ETG  [SP303101ETG]  (value not drawn)
D20  SP3031-01ETG  [SP303101ETG]  (value not drawn)
D21  SP3031-01ETG  [SP303101ETG]  (value not drawn)
D22  SP3031-01ETG  [SP303101ETG]  (value not drawn)
D23  SP3031-01ETG  [SP303101ETG]  (value not drawn)
D24  Note/Misc: 2.4V, GREEN  [LED_0805_GREEN]  (hidden comment: GREEN)
D25  Note/Misc: 2.4V, GREEN  [LED_0805_GREEN]  (hidden comment: GREEN)
FB4  120m  [FB_0201]
FB5  120m  [FB_0201]
J6  2x7Header  [67996114HLF]  (value not drawn)
J7  4xHeader  [HDRV4W95P0X254_1X4_1016X254X854P]  (value not drawn)
J8  TYPE-C-31-M-12  [HRO_TYPE-C-31-M-12]
R28  10k  [RES_0402]
R29  10k  [RES_0402]
R30  10k  [RES_0402]
R31  10k  [RES_0402]
R32  10k  [RES_0402]
R33  0R  [RES_0402]
R34  0R  [RES_0402]
R35  2.2k  [RES_0402]
R36  0R  [RES_0402]
R37  0R  [RES_0402]
R38  0R  [RES_0402]
R39  0R  [RES_0402]
R40  0R  [RES_0402]
R41  0R  [RES_0402]
R42  0R, DNP  [RES_0402]
R43  0R  [RES_0402]
R44  5.1k  [RES_0402]
R45  5.1k  [RES_0402]
R46  20k  [RES_0402]
R47  0R  [RES_0402]
R48  1k  [RES_0402]
R49  0R  [RES_0402]
R50  10k  [RES_0402]
R51  10k  [RES_0402]
R52  10k  [RES_0402]
R53  12k  Note/Misc: 1%  [RES_0402]
R54  150R  [RES_0402]
R55  2.2k  [RES_0402]
R56  4.7k  [RES_0402]
R57  150R  [RES_0402]
R58  10k  [RES_0402]
SW2  K3-1235S-F1  [K3-1235S-F1]
U6  FT2232HQ  [FP-FT2232HQ-Reel-IPC_C]
U7  TS3USB221RSER  [RSE(R-PUQFN-N10)]
U8  SN74AHC1G86DRLR  [SOTFL50P160X60-5N]
U9  93LC56B-I_SN  [SOIC127P600X175-8N]
X1  X1G004171001800  Note/Misc: 12MHz  [XTAL_2520]

### Nets
FTDI_1V8: C26.2 C27.2 C28.2 C37.2 U6.12(VCORE) U6.37(VCORE) U6.49(VREGOUT) U6.64(VCORE)
GND: C20.1 C21.1 C22.1 C23.1 C24.1 C25.1 C26.1 C27.1 C28.1 C29.1 C30.1 C31.1 C32.1 C33.1 C34.1 C35.1 C36.1 C37.1 C38.1 C39.1 D15.2(A) D16.2(A) D17.2(A) D18.2(A) D19.2(A) D20.2(A) D21.2(A) D22.2(A) D23.2(A) J6.1 J6.3 J6.5 J6.7 J6.9 J6.11 J6.13 J7.1 J7.3 J8.GND J8.SHLD(SHIELD) R41.2 R44.2 R45.2 R53.1 R58.2 SW2.3 U6.1(GND) U6.5(GND) U6.10(AGND) U6.11(GND) U6.13(TEST) U6.15(GND) U6.25(GND) U6.35(GND) U6.47(GND) U6.51(GND) U6.65(PGND) U7.5(GND) U8.3(GND) U9.5(VSS) X1.2(GND)
VCC_ROM: C20.2 C21.2 C22.2 C23.2 C31.2 C32.2 C33.2 C34.2 C35.2 C36.2 C39.2 D14.2 FB4.1 FB5.1 R28.1 R29.1 R30.1 R31.1 R32.1 R35.2 R40.2 R42.1 R48.1 R50.1 R51.1 R52.1 R54.2 R57.2 U6.20(VCCIO) U6.31(VCCIO) U6.42(VCCIO) U6.50(VREGIN) U6.56(VCCIO) U7.10(VCC) U8.5(VCC) U9.8(VCC) X1.1(~{ST}) X1.4(VCC)  [also labelled VCC_TS3, VCC_XOR, VDD_3V3]  [project net 3V3]
BCBUS: R56.2 R58.1 U6.59(BCBUS7)
FTDI_CLKIN: U6.2(OSCI) X1.3(OUT)
FTDI_nPOR: R41.1 U6.23(ADBUS6)
FTDI_RX_LED: D24.K U6.54(BCBUS3)
FTDI_TX_LED: D25.K U6.55(BCBUS4)
FTDI_UART_RX: R49.1 U6.39(BDBUS1)
FTDI_UART_TX: R47.1 U6.38(BDBUS0)
FTDI_VCCO_ON: R40.1 U6.21(ADBUS4)
nTRST: D21.1(K) J6.14 R32.2
TCK: D18.1(K) J6.6 R29.2 R36.2
TDI_USB/TDO_FPGA: D19.1(K) J6.8 R30.2 R38.2
TDO_USB/TDI_FPGA: D20.1(K) J6.10 R31.2 R37.2
TMS: D17.1(K) J6.4 R28.2 R39.2
UART_RX_FPGA: R33.1 R47.2
UART_TX_FPGA: R34.1 R49.2
USB_FTDI_N: U6.7(DM) U7.2(1D-)
USB_FTDI_P: U6.8(DP) U7.1(1D+)
USB_HUB1_N: U7.4(2D-)
USB_HUB1_P: U7.3(2D+)
USB_SW_N: D22.1(K) J8.DM(D-) U7.7(D-)
USB_SW_P: D23.1(K) J8.DP(D+) U7.8(D+)
VBUS1: J8.VBUS R56.1
NetC24_2: C24.2 C25.2 FB4.2 U6.9(VPLL)
NetC29_2: C29.2 C30.2 FB5.2 U6.4(VPHY)
NetC38_2: C38.2 R46.2 U8.2(B)
NetD14_1: D14.1 J6.2
NetD15_1: D15.1(K) J7.4 R34.2
NetD16_1: D16.1(K) J7.2 R33.2
NetD24_A: D24.A R54.1
NetD25_A: D25.A R57.1
NetJ8_A5: J8.A5(CC1) R45.1
NetJ8_B5: J8.B5(CC2) R44.1
NetR35_1: R35.1 SW2.1
NetR36_1: R36.1 U6.16(ADBUS0)
NetR37_1: R37.1 U6.17(ADBUS1)
NetR38_1: R38.1 U6.18(ADBUS2)
NetR39_1: R39.1 U6.19(ADBUS3)
NetR42_2: R42.2 R43.1 U7.6(~{OE})
NetR43_2: R43.2 U8.4(Y)
NetR46_1: R46.1 SW2.2(C) U7.9(S) U8.1(A)
NetR48_2: R48.2 U6.14(~{RESET})
NetR50_2: R50.2 R55.2 U9.4(DO)
NetR51_2: R51.2 U6.62(EECLK) U9.2(CLK)
NetR52_2: R52.2 U6.63(EECS) U9.1(CS)
NetR53_2: R53.2 U6.6(REF)
NetR55_1: R55.1 U6.61(EEDATA) U9.3(DI)

Not connected (* = marked no-connect by the designer): J6 12*; J8 A8(SBU1)* B8(SBU2)*; U6 3(OSCO)* 22(ADBUS5)* 24(ADBUS7)* 26(ACBUS0)* 27(ACBUS1)* 28(ACBUS2)* 29(ACBUS3)* 30(ACBUS4)* 32(ACBUS5)* 33(ACBUS6)* 34(ACBUS7)* 36(~{SUSPEND})* 40(BDBUS2)* 41(BDBUS3)* 43(BDBUS4)* 44(BDBUS5)* 45(BDBUS6)* 46(BDBUS7)* 48(BCBUS0)* 52(BCBUS1)* 53(BCBUS2)* 57(BCBUS5)* 58(BCBUS6)* 60(~{PWREN})*; U9 6(ORG)* 7(NC)*

### Layout directives
differential pair: USB_FTDI_N, USB_FTDI_P, USB_HUB1_N, USB_HUB1_P, USB_SW_N, USB_SW_P

### Notes on the sheet
- (near J7) UART Header
- (near J7) GND
- (near J6) JTAG Header
- (near J7) RX FPGA
- (near J7) TX FPGA
- All diodes SP3031-01ETG
- Note: JTAG Pins are not in order
- Standard pitch header pins, Xilinx cable layout for JTAG
- 1
- 2
- 3
- USB Hub
- Prog/Debug
- (near D23) All diodes SP3031-01ETG
- ALTAIR
- 1.0

### Library data of the parts
C20-C23 C25-C28 C30-C36 C39 = CAP_0402: as C13 on sheet SD & Boot; LCSC: *; JLCPCB Part #: C338112; Footprint JLCPCB: 0402
C24 C29 C37 = CAP_0402: Capacitor SMD 0402; Part No: HGC0402R5475M250NTEJ; LCSC: *; JLCPCB Part #: C22367824; Footprint JLCPCB: 0402
C38 = CAP_0402: as C6 on sheet Power; LCSC: *; JLCPCB Part #: C14445; Footprint JLCPCB: 0402
D14 = RB751V40,115: Schottky Diode; LCSC: *; Note/Misc: *; Part No: RB751V40,115; JLCPCB Part #: C553814; Footprint JLCPCB: SOD-323
D15-D23 = SP3031-01ETG: TVS Diode (Uni-directional); Footprint JLCPCB: SOD-882; JLCPCB Part #: C207283; LCSC: *; Note/Misc: *; Part No: SP3031-01ETG
D24 D25 = LED_0805_GREEN: LED 0805 GREEN SMD; Part No: 17-21SYGC/S530-E2/TR8; LCSC: *; Footprint JLCPCB: 0805; JLCPCB Part #: C2986046
FB4 FB5 = FB_0201: Ferrite Bead SMD 0201; Part No: MPZ0603S121HT000; LCSC: *; Note/Misc: *; JLCPCB Part #: C695597; Footprint JLCPCB: 0201
J6 = 2x7Header: Standard 2x7 pin 2.54mm pitch connector; Part No: X6521WV-2x07H-C60D30; Footprint JLCPCB: Plugin,P=2.54mm; JLCPCB Part #: C706897
J7 = 4xHeader: as J5 on sheet SD & Boot; Footprint JLCPCB: Plugin,P=2.54mm; JLCPCB Part #: C706876
J8 = TYPE-C-31-M-12: USB2.0, Type C, Top mount, CH 1.68mm, Dual Row SMT; LCSC: *; Note/Misc: *; Part No: TYPE-C-31-M-12; JLCPCB Part #: C165948; Footprint JLCPCB: SMD
R28-R32 R50-R52 R58 = RES_0402: as R2 on sheet Power; LCSC: *; JLCPCB Part #: C60489; Footprint JLCPCB: 0402
R33 R34 R36-R43 R47 R49 = RES_0402: as R6 on sheet Power; LCSC: *; JLCPCB Part #: C60485; Footprint JLCPCB: 0402
  R42: Note/Misc: DNP
R35 R55 = RES_0402: as R10 on sheet Power; LCSC: *; JLCPCB Part #: C163447; Footprint JLCPCB: 0402
R44 R45 = RES_0402: Resistor SMD 0402; Part No: RC0402JR-075K1L; LCSC: *; JLCPCB Part #: C105873; Footprint JLCPCB: 0402
R46 = RES_0402: as R17 on sheet SD & Boot; LCSC: *; JLCPCB Part #: C93942; Footprint JLCPCB: 0402
R48 = RES_0402: as R20 on sheet SD & Boot; LCSC: *; JLCPCB Part #: C105637; Footprint JLCPCB: 0402
R53 = RES_0402: Resistor SMD 0402; Part No: RC0402FR-0712KL; LCSC: *; JLCPCB Part #: C114760; Footprint JLCPCB: 0402
R54 R57 = RES_0402: Resistor SMD 0402; Part No: RC0402FR-07150RL; Note/Misc: 1%; LCSC: *; JLCPCB Part #: C138054; Footprint JLCPCB: 0402
R56 = RES_0402: Resistor SMD 0402; Part No: RC0402JR-074K7L; LCSC: *; JLCPCB Part #: C105870; Footprint JLCPCB: 0402
SW2 = K3-1235S-F1: Slide Switch SMD; LCSC: *; Note/Misc: *; Part No: K3-1235S-F1; JLCPCB Part #: C92660; Footprint JLCPCB: SMD
U6 = FT2232HQ-Reel: Dual High Speed USB To Multipurpose UART/FIFO IC, 64-pin LQFP, Tape and Reel; Footprint JLCPCB: QFN-64-EP(9x9); JLCPCB Part #: C193662; Part No: FT2232HQ
U7 = TS3USB221RSER: Diff Pair MUX/DEMUX; Footprint JLCPCB: UQFN-10(1.5x2); JLCPCB Part #: C130085; Part No: TS3USB221RSER
U8 = SN74AHC1G86DRLR: XOR Gate, 2 inputs 1 output; LCSC: *; Note/Misc: *; Part No: SN74AHC1G86DRLR; JLCPCB Part #: C2682053; Footprint JLCPCB: SOT-553-5
U9 = 93LC56B-I_SN: Integrated Circuit; Footprint JLCPCB: SOIC-8; JLCPCB Part #: C183620; Part No: 93LC56B-I_SN
X1 = X1G004171001800: Programmable Oscillator 12MHz; JLCPCB Part #: C255991; LCSC: *; Footprint JLCPCB: SMD2520-4P; Part No: X1G0041710018

## Sheet MIPI.SchDoc
size A3; SheetNumber: 6; SheetTotal: 11
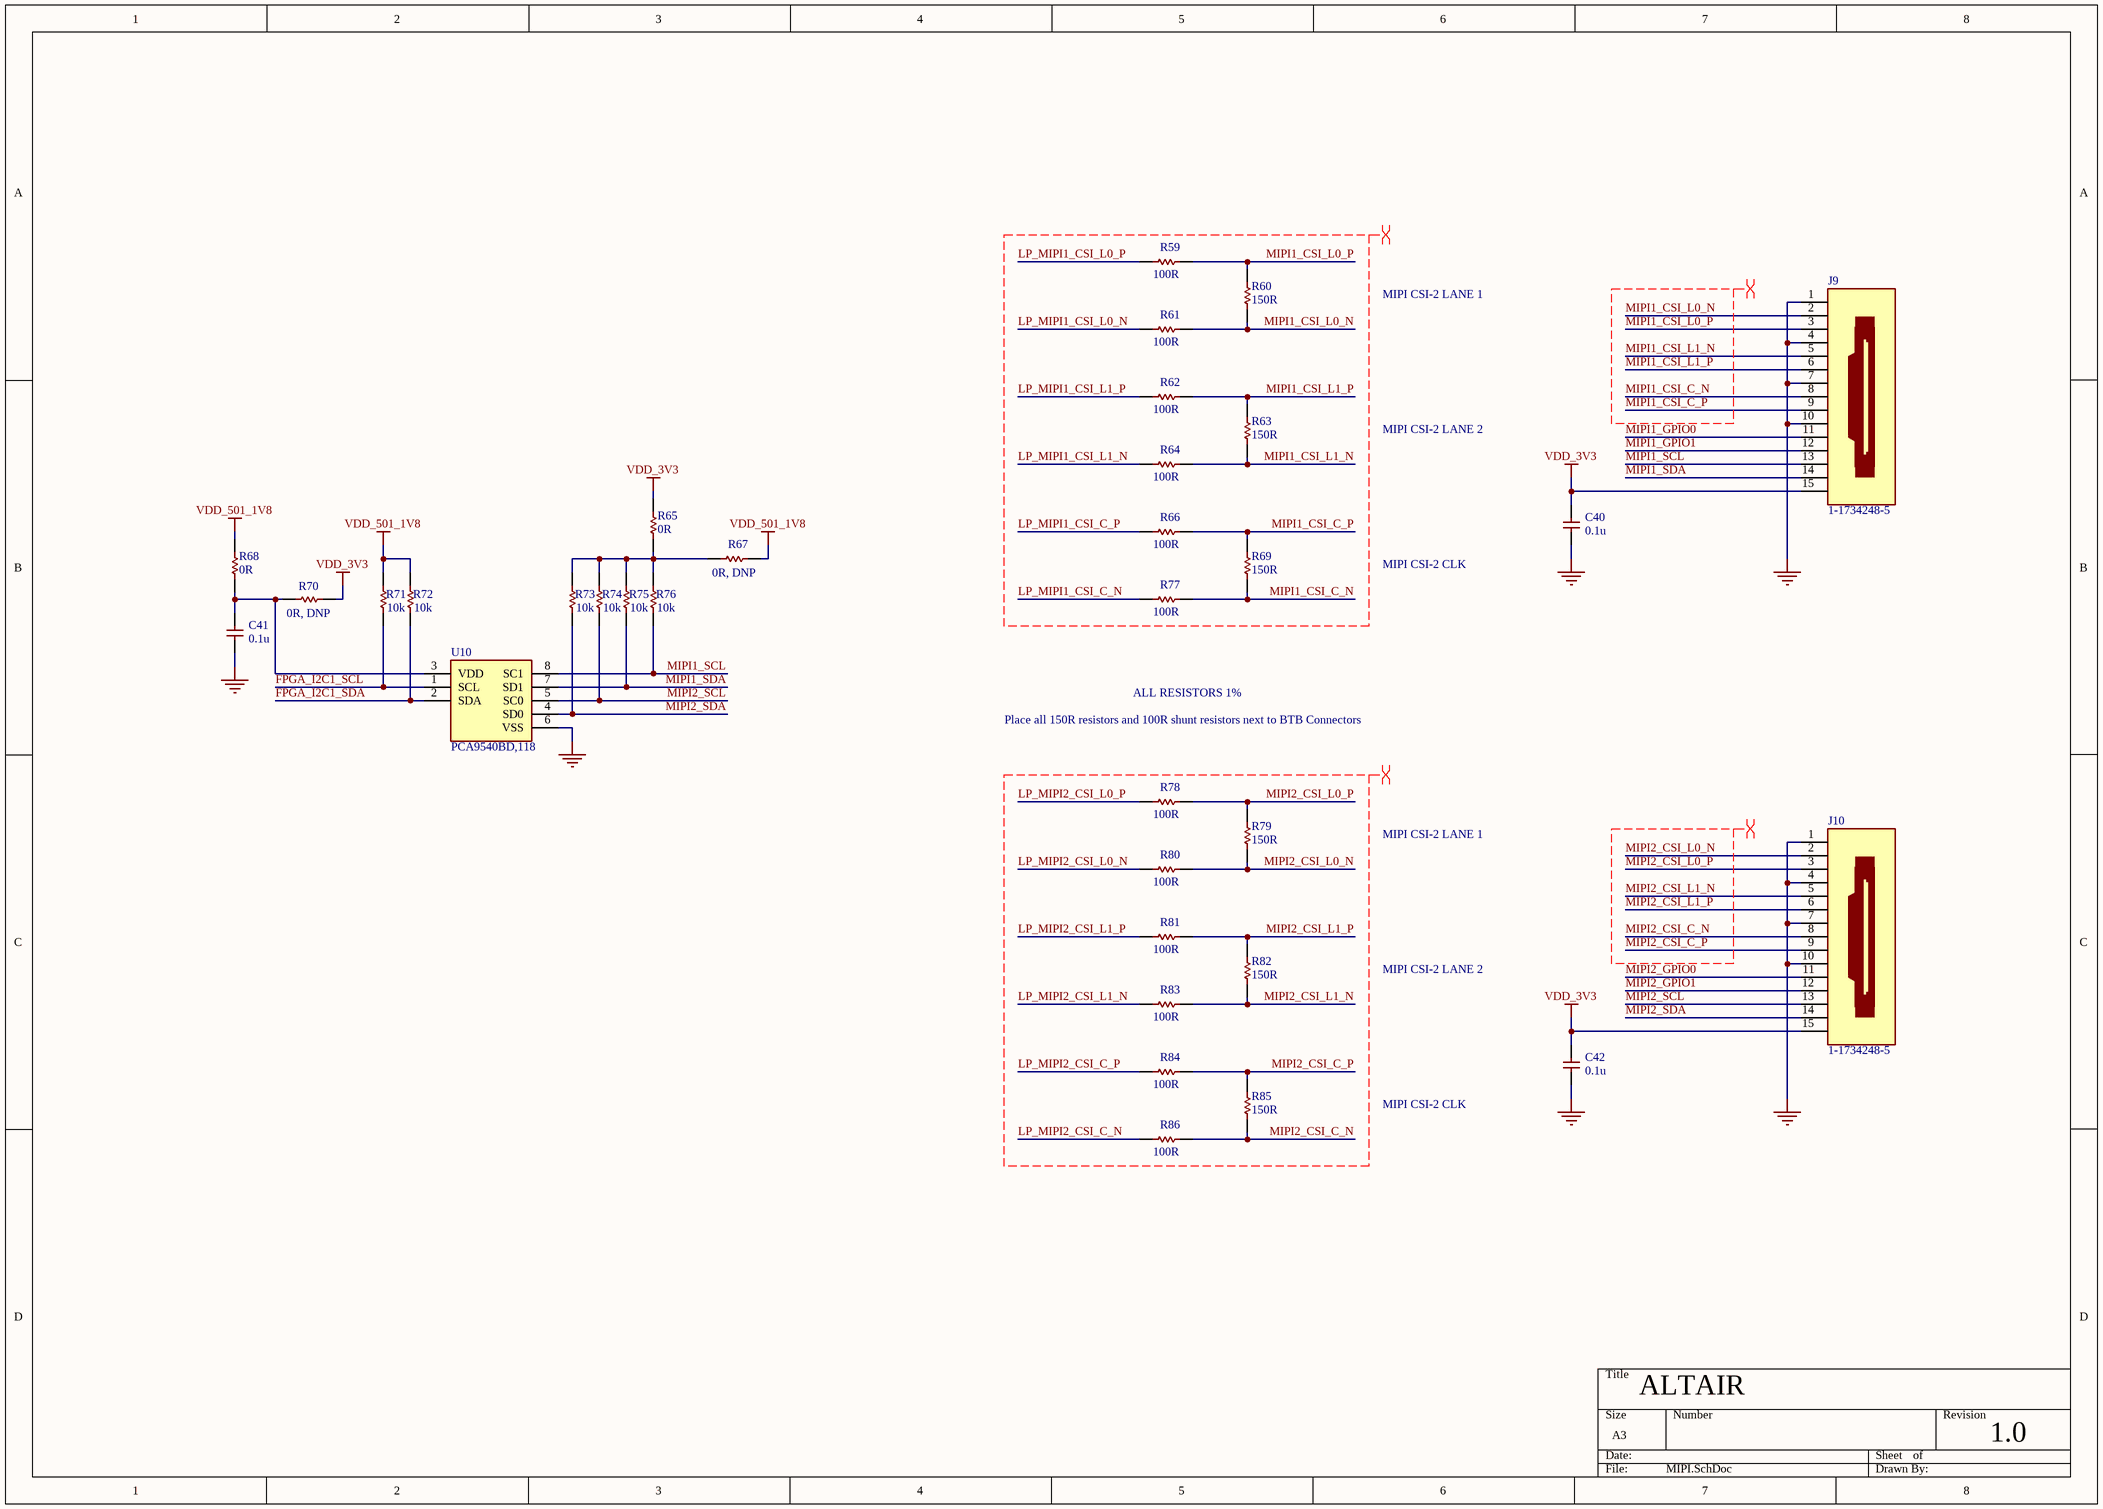
[diagram p5: MIPI.SchDoc]

### Parts
C40  0.1u  [CAP_0402]
C41  0.1u  [CAP_0402]
C42  0.1u  [CAP_0402]
J9  1-1734248-5  [FP-1-1734248-5-MFG]
J10  1-1734248-5  [FP-1-1734248-5-MFG]
R59  100R  [RES_0402]
R60  150R  [RES_0402]
R61  100R  [RES_0402]
R62  100R  [RES_0402]
R63  150R  [RES_0402]
R64  100R  [RES_0402]
R65  0R  [RES_0402]
R66  100R  [RES_0402]
R67  0R, DNP  [RES_0402]
R68  0R  [RES_0402]
R69  150R  [RES_0402]
R70  0R, DNP  [RES_0402]
R71  10k  [RES_0402]
R72  10k  [RES_0402]
R73  10k  [RES_0402]
R74  10k  [RES_0402]
R75  10k  [RES_0402]
R76  10k  [RES_0402]
R77  100R  [RES_0402]
R78  100R  [RES_0402]
R79  150R  [RES_0402]
R80  100R  [RES_0402]
R81  100R  [RES_0402]
R82  150R  [RES_0402]
R83  100R  [RES_0402]
R84  100R  [RES_0402]
R85  150R  [RES_0402]
R86  100R  [RES_0402]
U10  PCA9540BD,118  [SOIC127P600X175-8N]

### Nets
GND: C40.1 C41.1 C42.1 J9.1 J9.4 J9.7 J9.10 J10.1 J10.4 J10.7 J10.10 U10.6(VSS)
VDD_3V3: C40.2 C42.2 J9.15 J10.15 R65.2 R70.2  [project net 3V3]
VDD_501_1V8: R67.2 R68.2 R71.1 R72.1
FPGA_I2C1_SCL: R71.2 U10.1(SCL)
FPGA_I2C1_SDA: R72.2 U10.2(SDA)
LP_MIPI1_CSI_C_N: R77.1
LP_MIPI1_CSI_C_P: R66.1
LP_MIPI1_CSI_L0_N: R61.1
LP_MIPI1_CSI_L0_P: R59.1
LP_MIPI1_CSI_L1_N: R64.1
LP_MIPI1_CSI_L1_P: R62.1
LP_MIPI2_CSI_C_N: R86.1
LP_MIPI2_CSI_C_P: R84.1
LP_MIPI2_CSI_L0_N: R80.1
LP_MIPI2_CSI_L0_P: R78.1
LP_MIPI2_CSI_L1_N: R83.1
LP_MIPI2_CSI_L1_P: R81.1
MIPI1_CSI_C_N: J9.8 R69.2 R77.2
MIPI1_CSI_C_P: J9.9 R66.2 R69.1
MIPI1_CSI_L0_N: J9.2 R60.2 R61.2
MIPI1_CSI_L0_P: J9.3 R59.2 R60.1
MIPI1_CSI_L1_N: J9.5 R63.2 R64.2
MIPI1_CSI_L1_P: J9.6 R62.2 R63.1
MIPI1_GPIO0: J9.11
MIPI1_GPIO1: J9.12
MIPI1_SCL: J9.13 R76.2 U10.8(SC1)
MIPI1_SDA: J9.14 R75.2 U10.7(SD1)
MIPI2_CSI_C_N: J10.8 R85.2 R86.2
MIPI2_CSI_C_P: J10.9 R84.2 R85.1
MIPI2_CSI_L0_N: J10.2 R79.2 R80.2
MIPI2_CSI_L0_P: J10.3 R78.2 R79.1
MIPI2_CSI_L1_N: J10.5 R82.2 R83.2
MIPI2_CSI_L1_P: J10.6 R81.2 R82.1
MIPI2_GPIO0: J10.11
MIPI2_GPIO1: J10.12
MIPI2_SCL: J10.13 R74.2 U10.5(SC0)
MIPI2_SDA: J10.14 R73.2 U10.4(SD0)
NetC41_2: C41.2 R68.1 R70.1 U10.3(VDD)
NetR65_1: R65.1 R67.1 R73.1 R74.1 R75.1 R76.1

### Layout directives
differential pair: LP_MIPI1_CSI_C_N, LP_MIPI1_CSI_C_P, LP_MIPI1_CSI_L0_N, LP_MIPI1_CSI_L0_P, LP_MIPI1_CSI_L1_N, LP_MIPI1_CSI_L1_P, LP_MIPI2_CSI_C_N, LP_MIPI2_CSI_C_P, LP_MIPI2_CSI_L0_N, LP_MIPI2_CSI_L0_P, LP_MIPI2_CSI_L1_N, LP_MIPI2_CSI_L1_P, MIPI1_CSI_C_N, MIPI1_CSI_C_P, MIPI1_CSI_L0_N, MIPI1_CSI_L0_P, MIPI1_CSI_L1_N, MIPI1_CSI_L1_P, MIPI2_CSI_C_N, MIPI2_CSI_C_P, MIPI2_CSI_L0_N, MIPI2_CSI_L0_P, MIPI2_CSI_L1_N, MIPI2_CSI_L1_P

### Notes on the sheet
- MIPI CSI-2 LANE 1
- MIPI CSI-2 LANE 2
- MIPI CSI-2 CLK
- Place all 150R resistors and 100R shunt resistors next to BTB Connectors
- ALL RESISTORS 1%
- ALTAIR
- 1.0

### Library data of the parts
C40-C42 = CAP_0402: as C13 on sheet SD & Boot; LCSC: *; JLCPCB Part #: C338112; Footprint JLCPCB: 0402
J9 J10 = 1-1734248-5: FPC CONNECTOR VERT 15 PINS 1.00MM SMD; LCSC: *; Note/Misc: *; Part No: 1-1734248-5; JLCPCB Part #: C2922285; Footprint JLCPCB: SMD,P=1mm
R59 R61 R62 R64 R66 R77 R78 R80 R81 R83 R84 R86 = RES_0402: Resistor SMD 0402; Part No: RC0402FR-07100RL; Note/Misc: 1%; LCSC: *; JLCPCB Part #: C106232; Footprint JLCPCB: 0402
R60 R63 R69 R79 R82 R85 = RES_0402: as R54 on sheet FTDI; LCSC: *; JLCPCB Part #: C138054; Footprint JLCPCB: 0402
R65 R67 R68 R70 = RES_0402: as R6 on sheet Power; LCSC: *; JLCPCB Part #: C60485; Footprint JLCPCB: 0402
  R67 R70: Note/Misc: DNP
R71-R76 = RES_0402: as R2 on sheet Power; LCSC: *; JLCPCB Part #: C60489; Footprint JLCPCB: 0402
U10 = PCA9540BD,118: Integrated Circuit; LCSC: *; Note/Misc: *; Part No: PCA9540BD,118; JLCPCB Part #: C2674107; Footprint JLCPCB: SO-8

## Sheet HDMI1.SchDoc
size A3; SheetNumber: 7; SheetTotal: 11
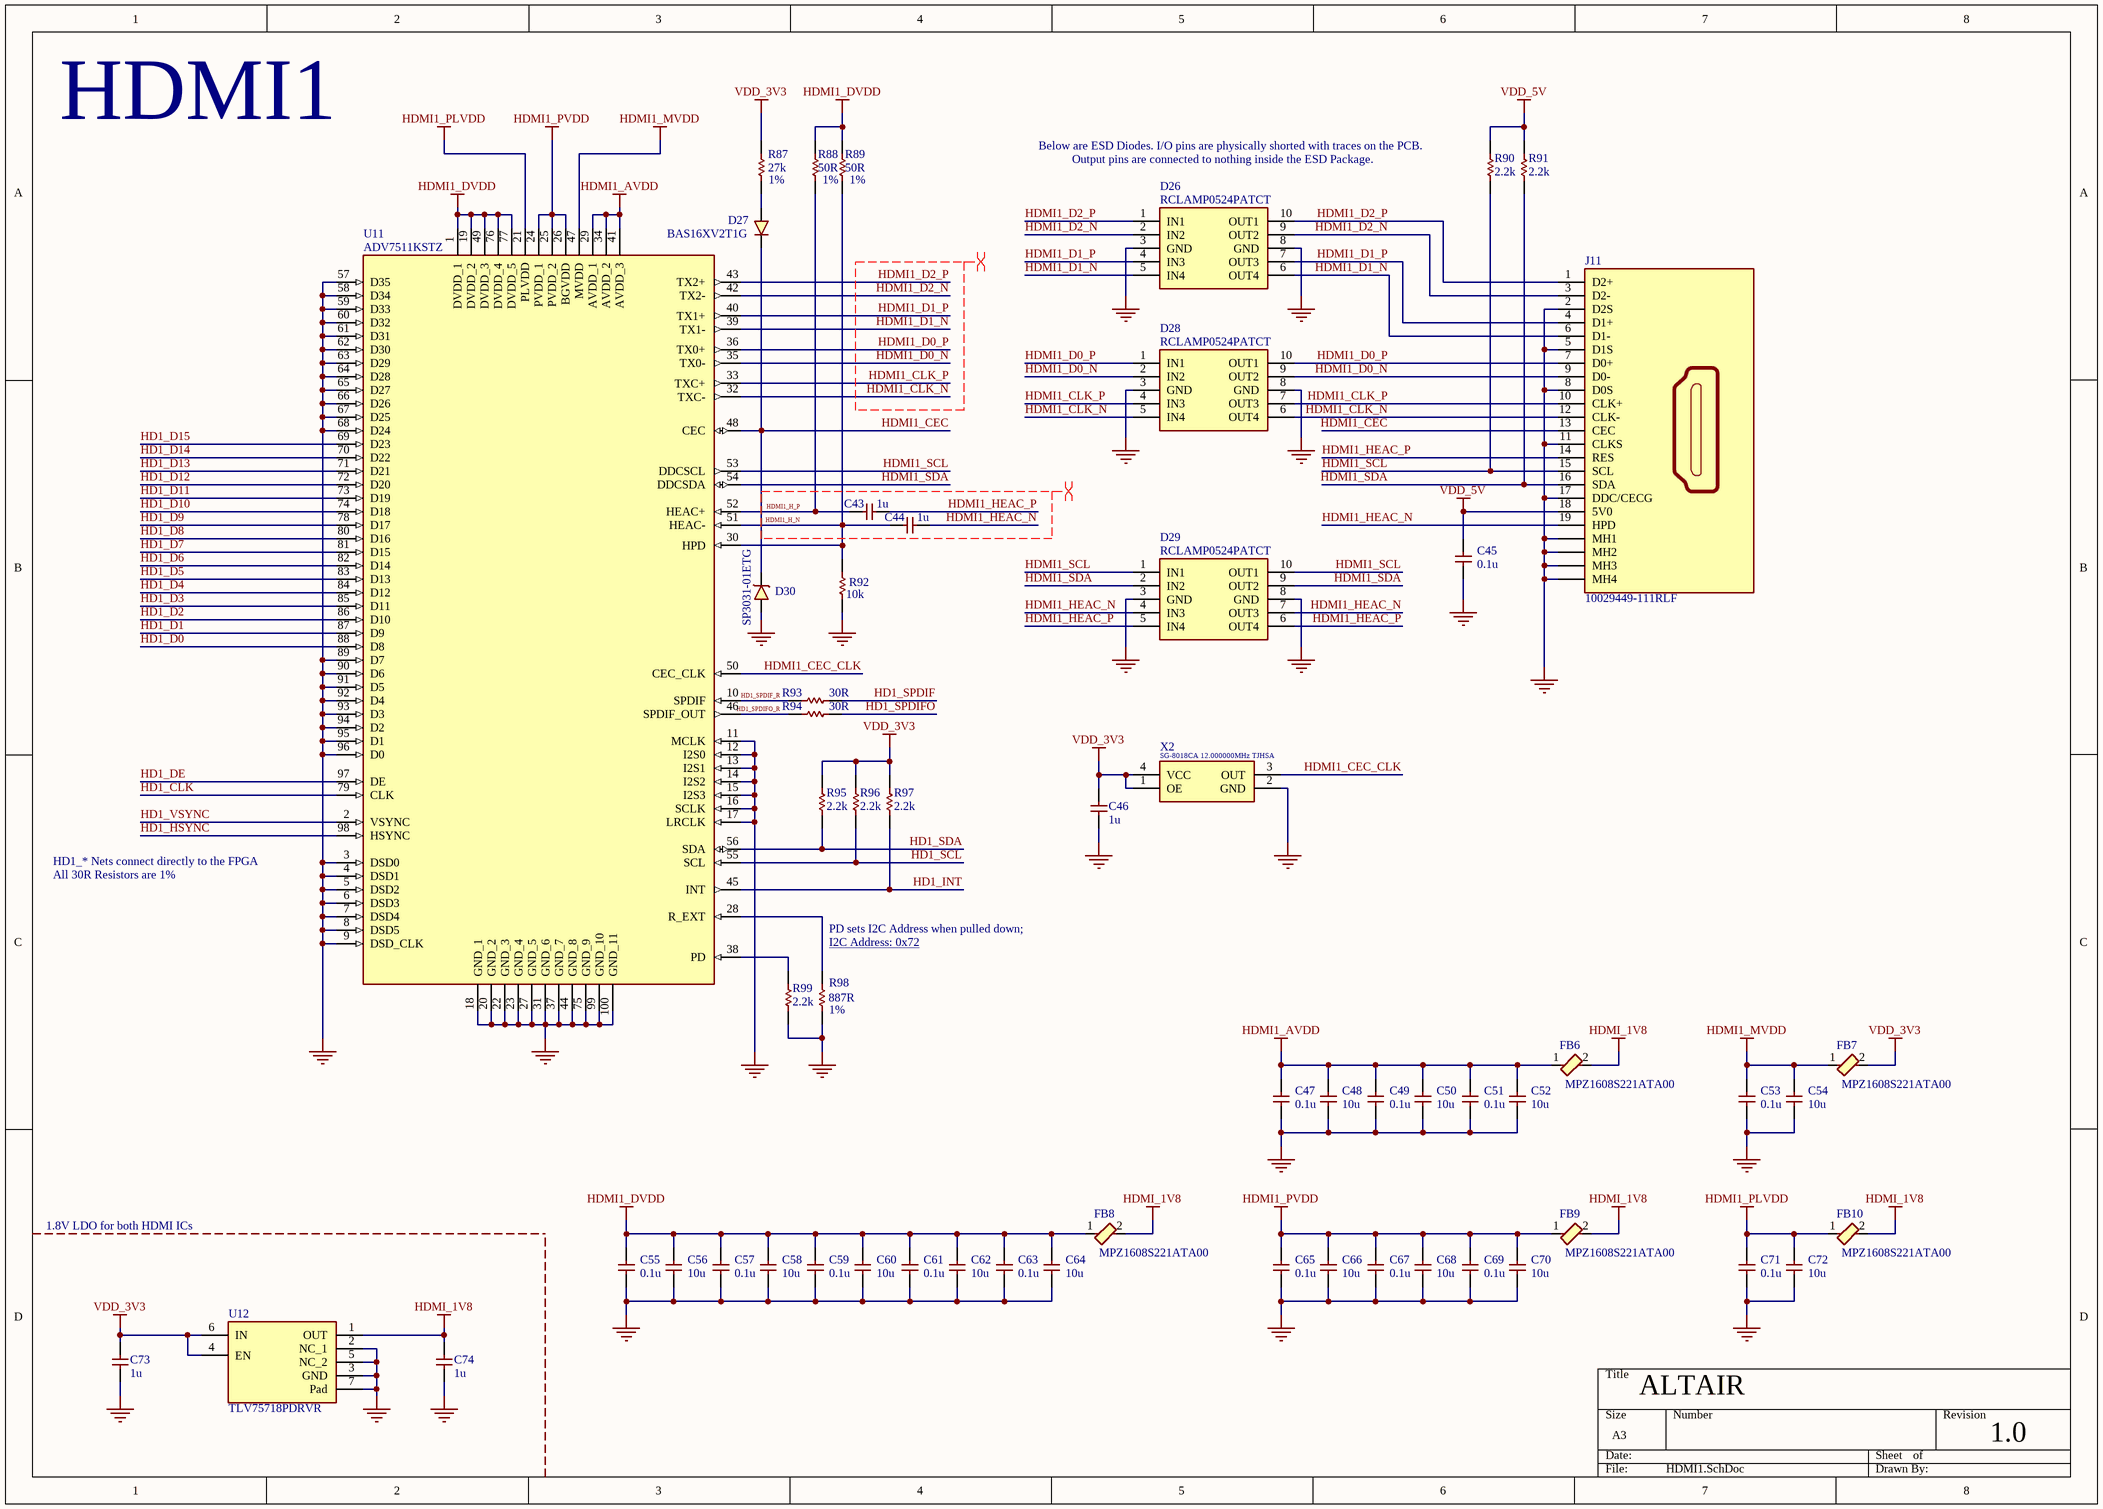
[diagram p6: HDMI1.SchDoc]

### Parts
C43  1u  [CAP_0402]
C44  1u  [CAP_0402]
C45  0.1u  [CAP_0402]
C46  1u  [CAP_0402]
C47  0.1u  [CAP_0402]
C48  10u  [CAP_0402]
C49  0.1u  [CAP_0402]
C50  10u  [CAP_0402]
C51  0.1u  [CAP_0402]
C52  10u  [CAP_0402]
C53  0.1u  [CAP_0402]
C54  10u  [CAP_0402]
C55  0.1u  [CAP_0402]
C56  10u  [CAP_0402]
C57  0.1u  [CAP_0402]
C58  10u  [CAP_0402]
C59  0.1u  [CAP_0402]
C60  10u  [CAP_0402]
C61  0.1u  [CAP_0402]
C62  10u  [CAP_0402]
C63  0.1u  [CAP_0402]
C64  10u  [CAP_0402]
C65  0.1u  [CAP_0402]
C66  10u  [CAP_0402]
C67  0.1u  [CAP_0402]
C68  10u  [CAP_0402]
C69  0.1u  [CAP_0402]
C70  10u  [CAP_0402]
C71  0.1u  [CAP_0402]
C72  10u  [CAP_0402]
C73  1u  [CAP_0402]
C74  1u  [CAP_0402]
D26  RCLAMP0524PATCT  [RCLAMP0524PATCT]
D27  BAS16XV2T1G  [SODFL1608X70N]
D28  RCLAMP0524PATCT  [RCLAMP0524PATCT]
D29  RCLAMP0524PATCT  [RCLAMP0524PATCT]
D30  SP3031-01ETG  [SP303101ETG]
FB6  220  [BEADC1608X75N]  (value not drawn)
FB7  220  [BEADC1608X75N]  (value not drawn)
FB8  220  [BEADC1608X75N]  (value not drawn)
FB9  220  [BEADC1608X75N]  (value not drawn)
FB10  220  [BEADC1608X75N]  (value not drawn)
J11  10029449-111RLF  [10029449111RLF]
R87  27k  Note/Misc: 1%  [RES_0402]
R88  50R  Note/Misc: 1%  [RES_0402]
R89  50R  Note/Misc: 1%  [RES_0402]
R90  2.2k  [RES_0402]
R91  2.2k  [RES_0402]
R92  10k  [RES_0402]
R93  30R  [RES_0402]
R94  30R  [RES_0402]
R95  2.2k  [RES_0402]
R96  2.2k  [RES_0402]
R97  2.2k  [RES_0402]
R98  887R  Note/Misc: 1%  [RES_0402]
R99  2.2k  [RES_0402]
U11  ADV7511KSTZ  [QFP50P1600X1600X160-100N]
U12  TLV75718PDRVR  [SON65P200X200X80-7N]
X2  SG-8018CA 12.000000MHz TJHSA  [SG8018CA147456MTJHPA3]  (value not drawn)

### Nets
GND: C45.1 C46.2 C47.1 C48.2 C49.1 C50.2 C51.1 C52.2 C53.1 C54.2 C55.1 C56.2 C57.1 C58.2 C59.1 C60.2 C61.1 C62.2 C63.1 C64.2 C65.1 C66.2 C67.1 C68.2 C69.1 C70.2 C71.1 C72.2 C73.2 C74.2 D26.3(GND) D26.8(GND) D28.3(GND) D28.8(GND) D29.3(GND) D29.8(GND) D30.2(A) J11.2(D2S) J11.5(D1S) J11.8(D0S) J11.11(CLKS) J11.17(DDC/CECG) J11.MH1 J11.MH2 J11.MH3 J11.MH4 R92.2 R98.2 R99.1 U11.3(DSD0) U11.4(DSD1) U11.5(DSD2) U11.6(DSD3) U11.7(DSD4) U11.8(DSD5) U11.9(DSD_CLK) U11.11(MCLK) U11.12(I2S0) U11.13(I2S1) U11.14(I2S2) U11.15(I2S3) U11.16(SCLK) U11.17(LRCLK) U11.18(GND_1) U11.20(GND_2) U11.22(GND_3) U11.23(GND_4) U11.27(GND_5) U11.31(GND_6) U11.37(GND_7) U11.44(GND_8) U11.57(D35) U11.58(D34) U11.59(D33) U11.60(D32) U11.61(D31) U11.62(D30) U11.63(D29) U11.64(D28) U11.65(D27) U11.66(D26) U11.67(D25) U11.68(D24) U11.75(GND_9) U11.89(D7) U11.90(D6) U11.91(D5) U11.92(D4) U11.93(D3) U11.94(D2) U11.95(D1) U11.96(D0) U11.99(GND_10) U11.100(GND_11) U12.2(NC_1) U12.3(GND) U12.5(NC_2) U12.7(Pad) X2.2(GND)
HDMI1_AVDD: C47.2 C48.1 C49.2 C50.1 C51.2 C52.1 FB6.1 U11.29(AVDD_1) U11.34(AVDD_2) U11.41(AVDD_3)
HDMI1_DVDD: C55.2 C56.1 C57.2 C58.1 C59.2 C60.1 C61.2 C62.1 C63.2 C64.1 FB8.1 R88.1 R89.1 U11.1(DVDD_1) U11.19(DVDD_2) U11.49(DVDD_3) U11.76(DVDD_4) U11.77(DVDD_5)
HDMI1_MVDD: C53.2 C54.1 FB7.1 U11.47(MVDD)
HDMI1_PLVDD: C71.2 C72.1 FB10.1 U11.21(PLVDD)
HDMI1_PVDD: C65.2 C66.1 C67.2 C68.1 C69.2 C70.1 FB9.1 U11.24(PVDD_1) U11.25(PVDD_2) U11.26(BGVDD)
HDMI_1V8: C74.1 FB6.2 FB8.2 FB9.2 FB10.2 U12.1(OUT)
VDD_3V3: C46.1 C73.1 FB7.2 R87.1 R95.2 R96.2 R97.2 U12.4(EN) U12.6(IN) X2.1(OE) X2.4(VCC)  [project net 3V3]
VDD_5V: C45.2 J11.18(5V0) R90.2 R91.2  [project net 5V]
HD1_CLK: U11.79(CLK)
HD1_D0: U11.88(D8)
HD1_D1: U11.87(D9)
HD1_D2: U11.86(D10)
HD1_D3: U11.85(D11)
HD1_D4: U11.84(D12)
HD1_D5: U11.83(D13)
HD1_D6: U11.82(D14)
HD1_D7: U11.81(D15)
HD1_D8: U11.80(D16)
HD1_D9: U11.78(D17)
HD1_D10: U11.74(D18)
HD1_D11: U11.73(D19)
HD1_D12: U11.72(D20)
HD1_D13: U11.71(D21)
HD1_D14: U11.70(D22)
HD1_D15: U11.69(D23)
HD1_DE: U11.97(DE)
HD1_HSYNC: U11.98(HSYNC)
HD1_INT: R97.1 U11.45(INT)
HD1_SCL: R96.1 U11.55(SCL)
HD1_SDA: R95.1 U11.56(SDA)
HD1_SPDIF: R93.2
HD1_SPDIF_R: R93.1 U11.10(SPDIF)
HD1_SPDIFO: R94.2
HD1_SPDIFO_R: R94.1 U11.46(SPDIF_OUT)
HD1_VSYNC: U11.2(VSYNC)
HDMI1_CEC: D27.1(K) D30.1(K) J11.13(CEC) U11.48(CEC)
HDMI1_CEC_CLK: U11.50(CEC_CLK) X2.3(OUT)
HDMI1_CLK_N: D28.5(IN4) D28.6(OUT4) J11.12(CLK-) U11.32(TXC-)
HDMI1_CLK_P: D28.4(IN3) D28.7(OUT3) J11.10(CLK+) U11.33(TXC+)
HDMI1_D0_N: D28.2(IN2) D28.9(OUT2) J11.9(D0-) U11.35(TX0-)
HDMI1_D0_P: D28.1(IN1) D28.10(OUT1) J11.7(D0+) U11.36(TX0+)
HDMI1_D1_N: D26.5(IN4) D26.6(OUT4) J11.6(D1-) U11.39(TX1-)
HDMI1_D1_P: D26.4(IN3) D26.7(OUT3) J11.4(D1+) U11.40(TX1+)
HDMI1_D2_N: D26.2(IN2) D26.9(OUT2) J11.3(D2-) U11.42(TX2-)
HDMI1_D2_P: D26.1(IN1) D26.10(OUT1) J11.1(D2+) U11.43(TX2+)
HDMI1_H_N: C44.2 R89.2 R92.1 U11.30(HPD) U11.51(HEAC-)
HDMI1_H_P: C43.2 R88.2 U11.52(HEAC+)
HDMI1_HEAC_N: C44.1 D29.4(IN3) D29.7(OUT3) J11.19(HPD)
HDMI1_HEAC_P: C43.1 D29.5(IN4) D29.6(OUT4) J11.14(RES)
HDMI1_SCL: D29.1(IN1) D29.10(OUT1) J11.15(SCL) R90.1 U11.53(DDCSCL)
HDMI1_SDA: D29.2(IN2) D29.9(OUT2) J11.16(SDA) R91.1 U11.54(DDCSDA)
NetD27_2: D27.2(A) R87.2
NetR98_1: R98.1 U11.28(R_EXT)
NetR99_2: R99.2 U11.38(PD)

### Layout directives
differential pair: HDMI1_CLK_N, HDMI1_CLK_P, HDMI1_D0_N, HDMI1_D0_P, HDMI1_D1_N, HDMI1_D1_P, HDMI1_D2_N, HDMI1_D2_P, HDMI1_H_N, HDMI1_H_P, HDMI1_HEAC_N, HDMI1_HEAC_P

### Notes on the sheet
- HDMI1
- (near R90) Below are ESD Diodes. I/O pins are physically shorted with traces on the PCB.
- Output pins are connected to nothing inside the ESD Package.
- (near X2) SG-8018CA 12.000000MHz TJHSA
- HD1_* Nets connect directly to the FPGA
- All 30R Resistors are 1%
- PD sets I2C Address when pulled down;
- I2C Address: 0x72
- 1.8V LDO for both HDMI ICs
- ALTAIR
- 1.0

### Library data of the parts
C43 C44 C46 C73 C74 = CAP_0402: as C6 on sheet Power; LCSC: *; JLCPCB Part #: C14445; Footprint JLCPCB: 0402
C45 C47 C49 C51 C53 C55 C57 C59 C61 C63 C65 C67 C69 C71 = CAP_0402: as C13 on sheet SD & Boot; LCSC: *; JLCPCB Part #: C338112; Footprint JLCPCB: 0402
C48 C50 C52 C54 C56 C58 C60 C62 C64 C66 C68 C70 C72 = CAP_0402: Capacitor SMD 0402; Part No: CL05A106MP5NUNC; LCSC: *; JLCPCB Part #: C315248; Footprint JLCPCB: 0402
D26 D28 D29 = RCLAMP0524PATCT: TVS Diode (Uni-directional); LCSC: *; Note/Misc: *; Part No: RCLAMP0524PATCT; JLCPCB Part #: C40960; Footprint JLCPCB: DFN-10(1x2.5)
D27 = BAS16XV2T1G: Diode (Switching); LCSC: *; Note/Misc: *; Part No: BAS16XV2T1G; JLCPCB Part #: C152479; Footprint JLCPCB: SOD-523
D30 = SP3031-01ETG: TVS Diode (Uni-directional); Footprint JLCPCB: SOD-882; JLCPCB Part #: C207283; LCSC: *; Note/Misc: *; Part No: SP3031-01ETG
FB6-FB10 = MPZ1608S221ATA00: Ferrite Bead; LCSC: *; Note/Misc: *; Part No: MPZ1608S221ATA00; JLCPCB Part #: C76815; Footprint JLCPCB: 0603
J11 = 10029449-111RLF: HDMI Connector; LCSC: *; Note/Misc: *; Part No: 10029449-111RLF; JLCPCB Part #: C427307; Footprint JLCPCB: SMD
R87 = RES_0402: Resistor SMD 0402; Part No: RC0402FR-0727KL; LCSC: *; JLCPCB Part #: C138022; Footprint JLCPCB: 0402
R88 R89 = RES_0402: Resistor SMD 0402; Part No: RT0402BRE0750RL; LCSC: *; JLCPCB Part #: C853312; Footprint JLCPCB: 0402
R90 R91 R95-R97 R99 = RES_0402: as R10 on sheet Power; LCSC: *; JLCPCB Part #: C163447; Footprint JLCPCB: 0402
R92 = RES_0402: as R2 on sheet Power; LCSC: *; JLCPCB Part #: C60489; Footprint JLCPCB: 0402
R93 R94 = RES_0402: Resistor SMD 0402; Part No: RC0402FR-0730RL; Note/Misc: 1%; LCSC: *; JLCPCB Part #: C138007; Footprint JLCPCB: 0402
R98 = RES_0402: Resistor SMD 0402; Part No: CRCW0402887RFKED; LCSC: *; JLCPCB Part #: C4012675; Footprint JLCPCB: 0402
U11 = ADV7511KSTZ: HDMI RX IC; LCSC: *; Note/Misc: *; Part No: ADV7511KSTZ; JLCPCB Part #: C179459; Footprint JLCPCB: LQFP-100(14x14)
U12 = TLV75718PDRVR: LDO 1V8, 1V45-5V5 Input; LCSC: *; Note/Misc: *; Part No: TLV75718PDRVR; JLCPCB Part #: C2861386; Footprint JLCPCB: WSON-6-EP(2x2)
X2 = SG-8018CA 12.000000MHz TJHSA: 12 MHz Programmable Oscillator; LCSC: *; Note/Misc: *; JLCPCB Part #: C390417; Footprint JLCPCB: SMD7050-4P; Part No: SG-8018CA 12.000000MHz TJHSA

## Sheet HDMI2.SchDoc
size A3; SheetNumber: 8; SheetTotal: 11
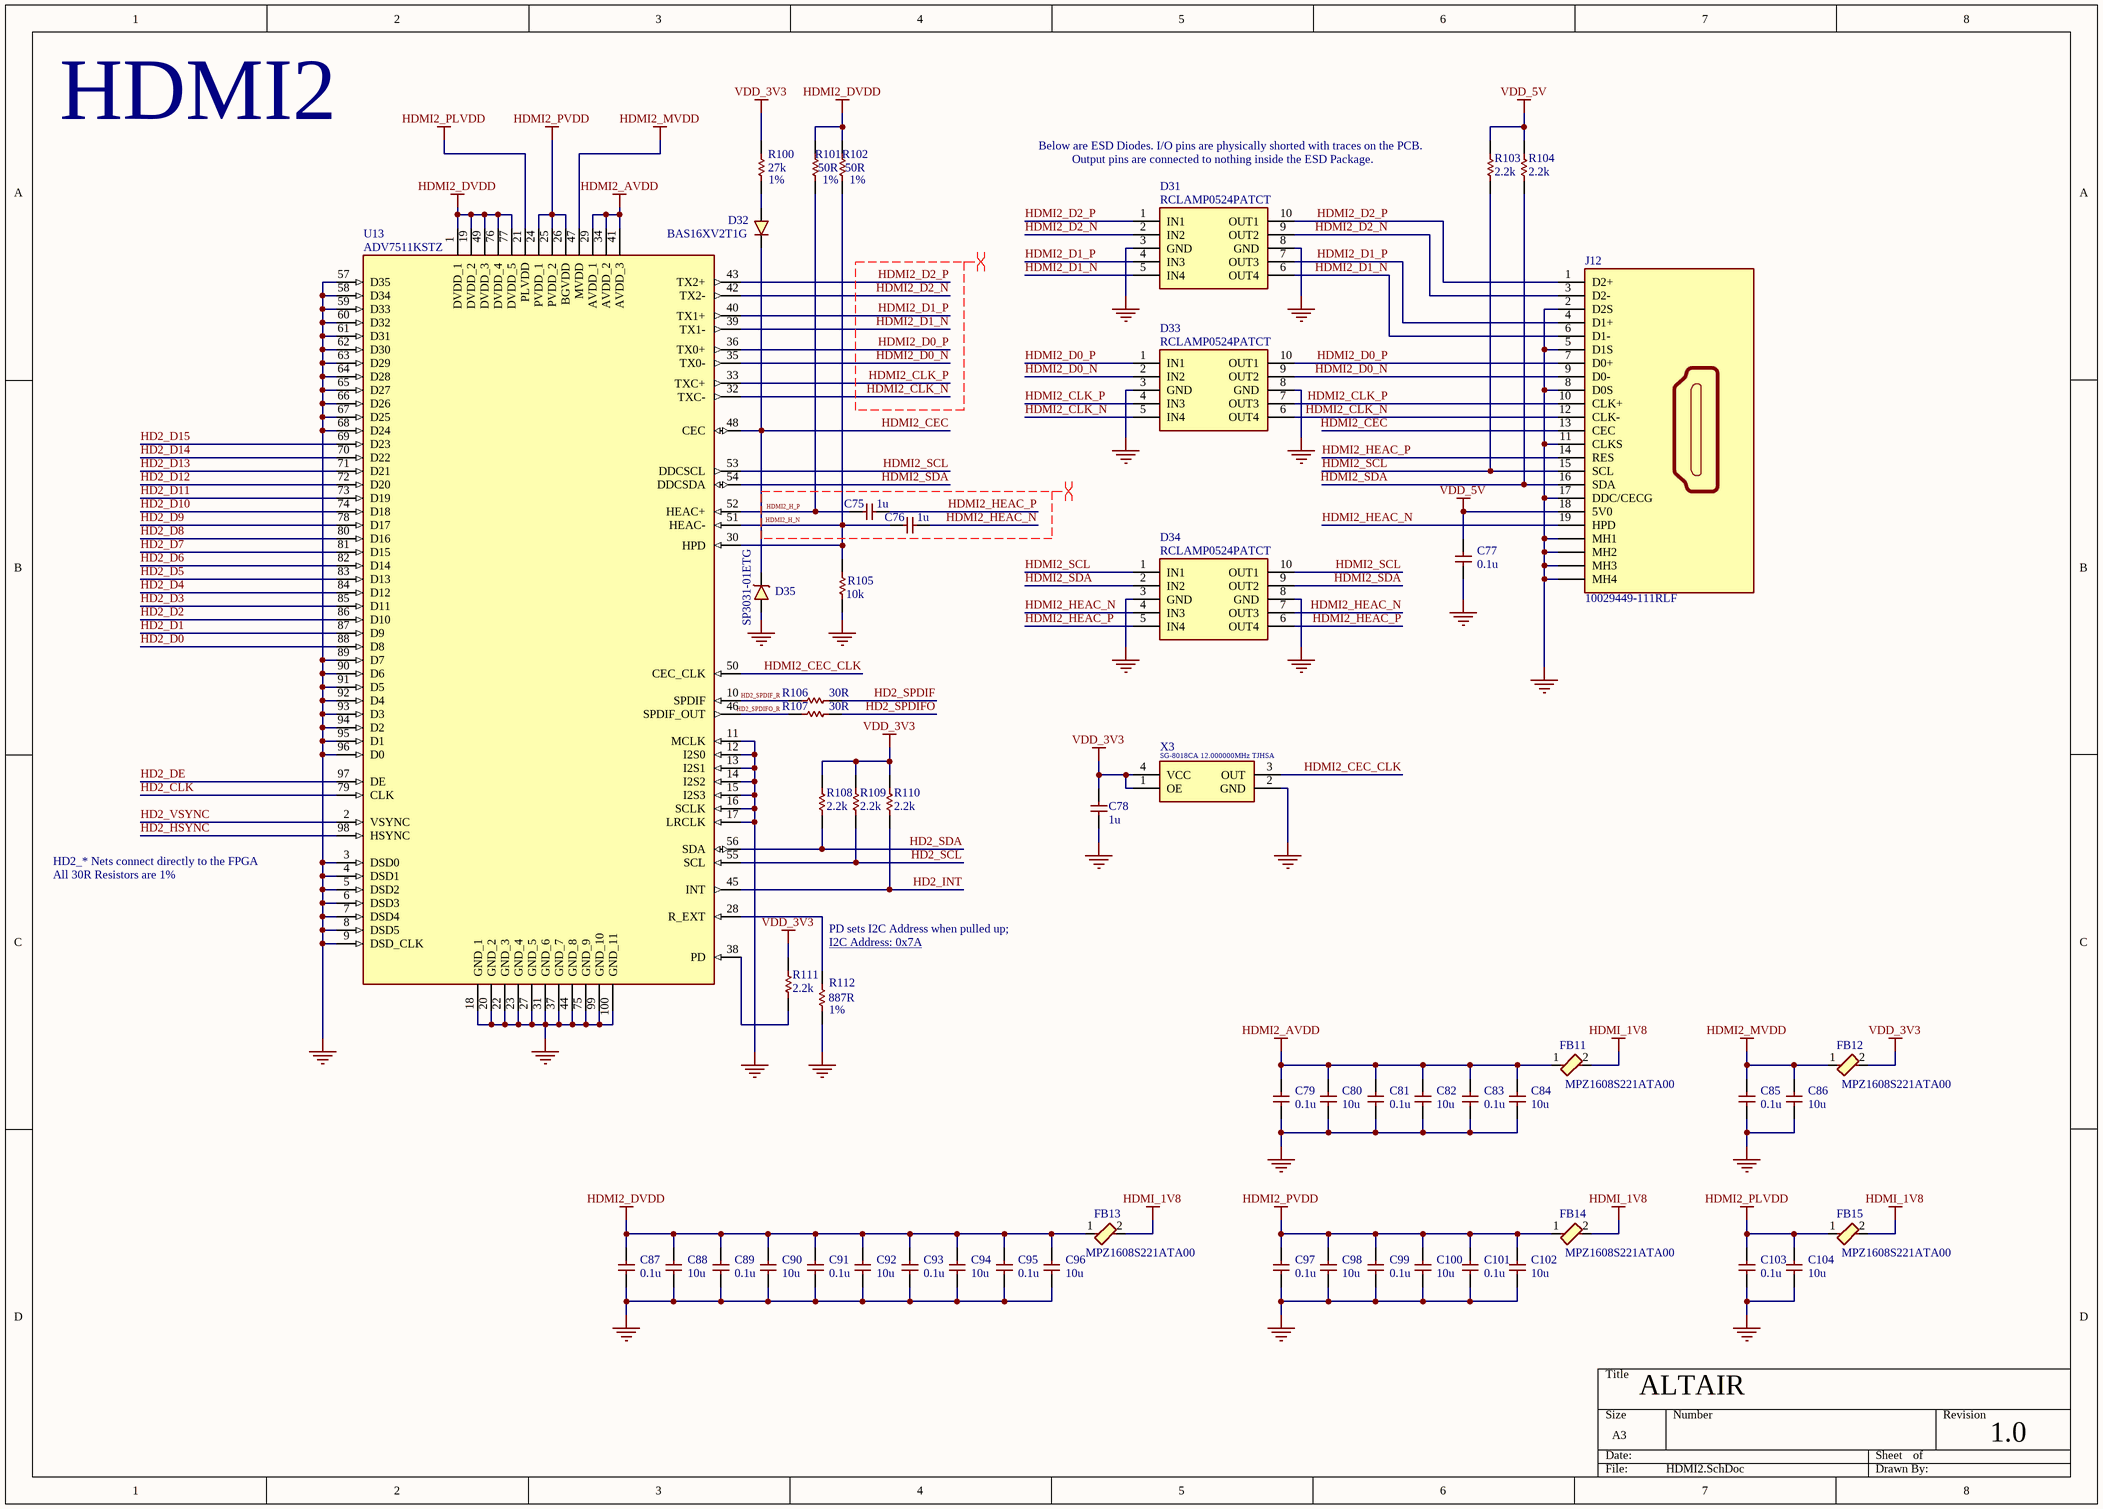
[diagram p7: HDMI2.SchDoc]

### Parts
C75  1u  [CAP_0402]
C76  1u  [CAP_0402]
C77  0.1u  [CAP_0402]
C78  1u  [CAP_0402]
C79  0.1u  [CAP_0402]
C80  10u  [CAP_0402]
C81  0.1u  [CAP_0402]
C82  10u  [CAP_0402]
C83  0.1u  [CAP_0402]
C84  10u  [CAP_0402]
C85  0.1u  [CAP_0402]
C86  10u  [CAP_0402]
C87  0.1u  [CAP_0402]
C88  10u  [CAP_0402]
C89  0.1u  [CAP_0402]
C90  10u  [CAP_0402]
C91  0.1u  [CAP_0402]
C92  10u  [CAP_0402]
C93  0.1u  [CAP_0402]
C94  10u  [CAP_0402]
C95  0.1u  [CAP_0402]
C96  10u  [CAP_0402]
C97  0.1u  [CAP_0402]
C98  10u  [CAP_0402]
C99  0.1u  [CAP_0402]
C100  10u  [CAP_0402]
C101  0.1u  [CAP_0402]
C102  10u  [CAP_0402]
C103  0.1u  [CAP_0402]
C104  10u  [CAP_0402]
D31  RCLAMP0524PATCT  [RCLAMP0524PATCT]
D32  BAS16XV2T1G  [SODFL1608X70N]
D33  RCLAMP0524PATCT  [RCLAMP0524PATCT]
D34  RCLAMP0524PATCT  [RCLAMP0524PATCT]
D35  SP3031-01ETG  [SP303101ETG]
FB11  220  [BEADC1608X75N]  (value not drawn)
FB12  220  [BEADC1608X75N]  (value not drawn)
FB13  220  [BEADC1608X75N]  (value not drawn)
FB14  220  [BEADC1608X75N]  (value not drawn)
FB15  220  [BEADC1608X75N]  (value not drawn)
J12  10029449-111RLF  [10029449111RLF]
R100  27k  Note/Misc: 1%  [RES_0402]
R101  50R  Note/Misc: 1%  [RES_0402]
R102  50R  Note/Misc: 1%  [RES_0402]
R103  2.2k  [RES_0402]
R104  2.2k  [RES_0402]
R105  10k  [RES_0402]
R106  30R  [RES_0402]
R107  30R  [RES_0402]
R108  2.2k  [RES_0402]
R109  2.2k  [RES_0402]
R110  2.2k  [RES_0402]
R111  2.2k  [RES_0402]
R112  887R  Note/Misc: 1%  [RES_0402]
U13  ADV7511KSTZ  [QFP50P1600X1600X160-100N]
X3  SG-8018CA 12.000000MHz TJHSA  [SG8018CA147456MTJHPA3]  (value not drawn)

### Nets
GND: C77.1 C78.2 C79.1 C80.2 C81.1 C82.2 C83.1 C84.2 C85.1 C86.2 C87.1 C88.2 C89.1 C90.2 C91.1 C92.2 C93.1 C94.2 C95.1 C96.2 C97.1 C98.2 C99.1 C100.2 C101.1 C102.2 C103.1 C104.2 D31.3(GND) D31.8(GND) D33.3(GND) D33.8(GND) D34.3(GND) D34.8(GND) D35.2(A) J12.2(D2S) J12.5(D1S) J12.8(D0S) J12.11(CLKS) J12.17(DDC/CECG) J12.MH1 J12.MH2 J12.MH3 J12.MH4 R105.2 R112.2 U13.3(DSD0) U13.4(DSD1) U13.5(DSD2) U13.6(DSD3) U13.7(DSD4) U13.8(DSD5) U13.9(DSD_CLK) U13.11(MCLK) U13.12(I2S0) U13.13(I2S1) U13.14(I2S2) U13.15(I2S3) U13.16(SCLK) U13.17(LRCLK) U13.18(GND_1) U13.20(GND_2) U13.22(GND_3) U13.23(GND_4) U13.27(GND_5) U13.31(GND_6) U13.37(GND_7) U13.44(GND_8) U13.57(D35) U13.58(D34) U13.59(D33) U13.60(D32) U13.61(D31) U13.62(D30) U13.63(D29) U13.64(D28) U13.65(D27) U13.66(D26) U13.67(D25) U13.68(D24) U13.75(GND_9) U13.89(D7) U13.90(D6) U13.91(D5) U13.92(D4) U13.93(D3) U13.94(D2) U13.95(D1) U13.96(D0) U13.99(GND_10) U13.100(GND_11) X3.2(GND)
HDMI2_AVDD: C79.2 C80.1 C81.2 C82.1 C83.2 C84.1 FB11.1 U13.29(AVDD_1) U13.34(AVDD_2) U13.41(AVDD_3)
HDMI2_DVDD: C87.2 C88.1 C89.2 C90.1 C91.2 C92.1 C93.2 C94.1 C95.2 C96.1 FB13.1 R101.1 R102.1 U13.1(DVDD_1) U13.19(DVDD_2) U13.49(DVDD_3) U13.76(DVDD_4) U13.77(DVDD_5)
HDMI2_MVDD: C85.2 C86.1 FB12.1 U13.47(MVDD)
HDMI2_PLVDD: C103.2 C104.1 FB15.1 U13.21(PLVDD)
HDMI2_PVDD: C97.2 C98.1 C99.2 C100.1 C101.2 C102.1 FB14.1 U13.24(PVDD_1) U13.25(PVDD_2) U13.26(BGVDD)
HDMI_1V8: FB11.2 FB13.2 FB14.2 FB15.2
VDD_3V3: C78.1 FB12.2 R100.1 R108.2 R109.2 R110.2 R111.1 X3.1(OE) X3.4(VCC)  [project net 3V3]
VDD_5V: C77.2 J12.18(5V0) R103.2 R104.2  [project net 5V]
HD2_CLK: U13.79(CLK)
HD2_D0: U13.88(D8)
HD2_D1: U13.87(D9)
HD2_D2: U13.86(D10)
HD2_D3: U13.85(D11)
HD2_D4: U13.84(D12)
HD2_D5: U13.83(D13)
HD2_D6: U13.82(D14)
HD2_D7: U13.81(D15)
HD2_D8: U13.80(D16)
HD2_D9: U13.78(D17)
HD2_D10: U13.74(D18)
HD2_D11: U13.73(D19)
HD2_D12: U13.72(D20)
HD2_D13: U13.71(D21)
HD2_D14: U13.70(D22)
HD2_D15: U13.69(D23)
HD2_DE: U13.97(DE)
HD2_HSYNC: U13.98(HSYNC)
HD2_INT: R110.1 U13.45(INT)
HD2_SCL: R109.1 U13.55(SCL)
HD2_SDA: R108.1 U13.56(SDA)
HD2_SPDIF: R106.2
HD2_SPDIF_R: R106.1 U13.10(SPDIF)
HD2_SPDIFO: R107.2
HD2_SPDIFO_R: R107.1 U13.46(SPDIF_OUT)
HD2_VSYNC: U13.2(VSYNC)
HDMI2_CEC: D32.1(K) D35.1(K) J12.13(CEC) U13.48(CEC)
HDMI2_CEC_CLK: U13.50(CEC_CLK) X3.3(OUT)
HDMI2_CLK_N: D33.5(IN4) D33.6(OUT4) J12.12(CLK-) U13.32(TXC-)
HDMI2_CLK_P: D33.4(IN3) D33.7(OUT3) J12.10(CLK+) U13.33(TXC+)
HDMI2_D0_N: D33.2(IN2) D33.9(OUT2) J12.9(D0-) U13.35(TX0-)
HDMI2_D0_P: D33.1(IN1) D33.10(OUT1) J12.7(D0+) U13.36(TX0+)
HDMI2_D1_N: D31.5(IN4) D31.6(OUT4) J12.6(D1-) U13.39(TX1-)
HDMI2_D1_P: D31.4(IN3) D31.7(OUT3) J12.4(D1+) U13.40(TX1+)
HDMI2_D2_N: D31.2(IN2) D31.9(OUT2) J12.3(D2-) U13.42(TX2-)
HDMI2_D2_P: D31.1(IN1) D31.10(OUT1) J12.1(D2+) U13.43(TX2+)
HDMI2_H_N: C76.2 R102.2 R105.1 U13.30(HPD) U13.51(HEAC-)
HDMI2_H_P: C75.2 R101.2 U13.52(HEAC+)
HDMI2_HEAC_N: C76.1 D34.4(IN3) D34.7(OUT3) J12.19(HPD)
HDMI2_HEAC_P: C75.1 D34.5(IN4) D34.6(OUT4) J12.14(RES)
HDMI2_SCL: D34.1(IN1) D34.10(OUT1) J12.15(SCL) R103.1 U13.53(DDCSCL)
HDMI2_SDA: D34.2(IN2) D34.9(OUT2) J12.16(SDA) R104.1 U13.54(DDCSDA)
NetD32_2: D32.2(A) R100.2
NetR111_2: R111.2 U13.38(PD)
NetR112_1: R112.1 U13.28(R_EXT)

### Layout directives
differential pair: HDMI2_CLK_N, HDMI2_CLK_P, HDMI2_D0_N, HDMI2_D0_P, HDMI2_D1_N, HDMI2_D1_P, HDMI2_D2_N, HDMI2_D2_P, HDMI2_H_N, HDMI2_H_P, HDMI2_HEAC_N, HDMI2_HEAC_P

### Notes on the sheet
- HDMI2
- (near R103) Below are ESD Diodes. I/O pins are physically shorted with traces on the PCB.
- Output pins are connected to nothing inside the ESD Package.
- (near X3) SG-8018CA 12.000000MHz TJHSA
- HD2_* Nets connect directly to the FPGA
- All 30R Resistors are 1%
- PD sets I2C Address when pulled up;
- I2C Address: 0x7A
- ALTAIR
- 1.0

### Library data of the parts
C75 C76 C78 = CAP_0402: as C6 on sheet Power; LCSC: *; JLCPCB Part #: C14445; Footprint JLCPCB: 0402
C77 C79 C81 C83 C85 C87 C89 C91 C93 C95 C97 C99 C101 C103 = CAP_0402: as C13 on sheet SD & Boot; LCSC: *; JLCPCB Part #: C338112; Footprint JLCPCB: 0402
C80 C82 C84 C86 C88 C90 C92 C94 C96 C98 C100 C102 C104 = CAP_0402: as C48 on sheet HDMI1; LCSC: *; JLCPCB Part #: C315248; Footprint JLCPCB: 0402
D31 D33 D34 = RCLAMP0524PATCT: TVS Diode (Uni-directional); LCSC: *; Note/Misc: *; Part No: RCLAMP0524PATCT; JLCPCB Part #: C40960; Footprint JLCPCB: DFN-10(1x2.5)
D32 = BAS16XV2T1G: Diode (Switching); LCSC: *; Note/Misc: *; Part No: BAS16XV2T1G; JLCPCB Part #: C152479; Footprint JLCPCB: SOD-523
D35 = SP3031-01ETG: TVS Diode (Uni-directional); Footprint JLCPCB: SOD-882; JLCPCB Part #: C207283; LCSC: *; Note/Misc: *; Part No: SP3031-01ETG
FB11-FB15 = MPZ1608S221ATA00: Ferrite Bead; LCSC: *; Note/Misc: *; Part No: MPZ1608S221ATA00; JLCPCB Part #: C76815; Footprint JLCPCB: 0603
J12 = 10029449-111RLF: HDMI Connector; LCSC: *; Note/Misc: *; Part No: 10029449-111RLF; JLCPCB Part #: C427307; Footprint JLCPCB: SMD
R100 = RES_0402: as R87 on sheet HDMI1; LCSC: *; JLCPCB Part #: C138022; Footprint JLCPCB: 0402
R101 R102 = RES_0402: as R88 on sheet HDMI1; LCSC: *; JLCPCB Part #: C853312; Footprint JLCPCB: 0402
R103 R104 R108-R111 = RES_0402: as R10 on sheet Power; LCSC: *; JLCPCB Part #: C163447; Footprint JLCPCB: 0402
R105 = RES_0402: as R2 on sheet Power; LCSC: *; JLCPCB Part #: C60489; Footprint JLCPCB: 0402
R106 R107 = RES_0402: as R93 on sheet HDMI1; LCSC: *; JLCPCB Part #: C138007; Footprint JLCPCB: 0402
R112 = RES_0402: as R98 on sheet HDMI1; LCSC: *; JLCPCB Part #: C4012675; Footprint JLCPCB: 0402
U13 = ADV7511KSTZ: HDMI RX IC; LCSC: *; Note/Misc: *; Part No: ADV7511KSTZ; JLCPCB Part #: C179459; Footprint JLCPCB: LQFP-100(14x14)
X3 = SG-8018CA 12.000000MHz TJHSA: 12 MHz Programmable Oscillator; LCSC: *; Note/Misc: *; JLCPCB Part #: C390417; Footprint JLCPCB: SMD7050-4P; Part No: SG-8018CA 12.000000MHz TJHSA